# Altium project Medtrack_YLDB.PrjPCB
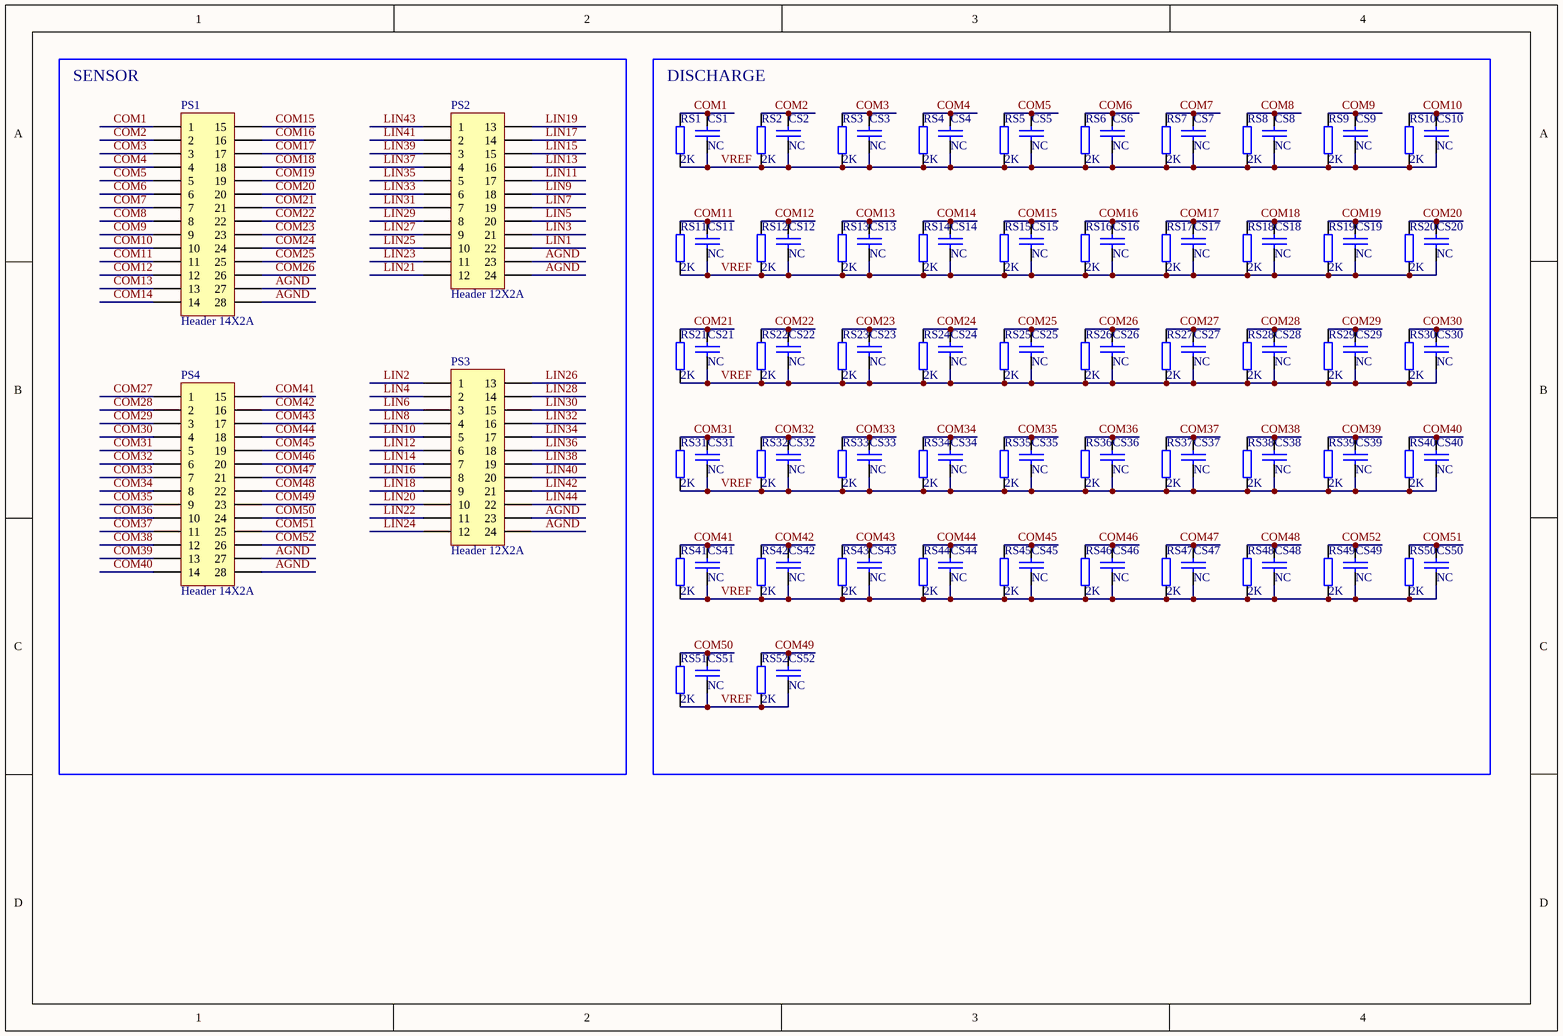
[diagram p0: Pressure_SENSOR.SchDoc]
6 sheets, 532 parts. Net scope: global (net labels, ports and power ports of the same name join across sheets).
Board file: Medtrack_YLDB_V2.0.PcbDoc
Sheets:
  Pressure_SENSOR.SchDoc
  Pressure_PM.SchDoc
  Pressure_INPUT.SchDoc
  Pressure_OUTPUT.SchDoc
  Pressure_MCU407.SchDoc
  Pressure_ADIN.SchDoc

## Sheet Pressure_SENSOR.SchDoc
size A4

### Parts
CS1  NC  [c0603_HSC100]
CS2  NC  [c0603_HSC100]
CS3  NC  [c0603_HSC100]
CS4  NC  [c0603_HSC100]
CS5  NC  [c0603_HSC100]
CS6  NC  [c0603_HSC100]
CS7  NC  [c0603_HSC100]
CS8  NC  [c0603_HSC100]
CS9  NC  [c0603_HSC100]
CS10  NC  [c0603_HSC100]
CS11  NC  [c0603_HSC100]
CS12  NC  [c0603_HSC100]
CS13  NC  [c0603_HSC100]
CS14  NC  [c0603_HSC100]
CS15  NC  [c0603_HSC100]
CS16  NC  [c0603_HSC100]
CS17  NC  [c0603_HSC100]
CS18  NC  [c0603_HSC100]
CS19  NC  [c0603_HSC100]
CS20  NC  [c0603_HSC100]
CS21  NC  [c0603_HSC100]
CS22  NC  [c0603_HSC100]
CS23  NC  [c0603_HSC100]
CS24  NC  [c0603_HSC100]
CS25  NC  [c0603_HSC100]
CS26  NC  [c0603_HSC100]
CS27  NC  [c0603_HSC100]
CS28  NC  [c0603_HSC100]
CS29  NC  [c0603_HSC100]
CS30  NC  [c0603_HSC100]
CS31  NC  [c0603_HSC100]
CS32  NC  [c0603_HSC100]
CS33  NC  [c0603_HSC100]
CS34  NC  [c0603_HSC100]
CS35  NC  [c0603_HSC100]
CS36  NC  [c0603_HSC100]
CS37  NC  [c0603_HSC100]
CS38  NC  [c0603_HSC100]
CS39  NC  [c0603_HSC100]
CS40  NC  [c0603_HSC100]
CS41  NC  [c0603_HSC100]
CS42  NC  [c0603_HSC100]
CS43  NC  [c0603_HSC100]
CS44  NC  [c0603_HSC100]
CS45  NC  [c0603_HSC100]
CS46  NC  [c0603_HSC100]
CS47  NC  [c0603_HSC100]
CS48  NC  [c0603_HSC100]
CS49  NC  [c0603_HSC100]
CS50  NC  [c0603_HSC100]
CS51  NC  [c0603_HSC100]
CS52  NC  [c0603_HSC100]
PS1  Header 14X2A  [FPC-1.0-26]
PS2  Header 12X2A  [FPC-1.0-22]
PS3  Header 12X2A  [FPC-1.0-22]
PS4  Header 14X2A  [FPC-1.0-26]
RS1  2K  [R0603_HSC100]
RS2  2K  [R0603_HSC100]
RS3  2K  [R0603_HSC100]
RS4  2K  [R0603_HSC100]
RS5  2K  [R0603_HSC100]
RS6  2K  [R0603_HSC100]
RS7  2K  [R0603_HSC100]
RS8  2K  [R0603_HSC100]
RS9  2K  [R0603_HSC100]
RS10  2K  [R0603_HSC100]
RS11  2K  [R0603_HSC100]
RS12  2K  [R0603_HSC100]
RS13  2K  [R0603_HSC100]
RS14  2K  [R0603_HSC100]
RS15  2K  [R0603_HSC100]
RS16  2K  [R0603_HSC100]
RS17  2K  [R0603_HSC100]
RS18  2K  [R0603_HSC100]
RS19  2K  [R0603_HSC100]
RS20  2K  [R0603_HSC100]
RS21  2K  [R0603_HSC100]
RS22  2K  [R0603_HSC100]
RS23  2K  [R0603_HSC100]
RS24  2K  [R0603_HSC100]
RS25  2K  [R0603_HSC100]
RS26  2K  [R0603_HSC100]
RS27  2K  [R0603_HSC100]
RS28  2K  [R0603_HSC100]
RS29  2K  [R0603_HSC100]
RS30  2K  [R0603_HSC100]
RS31  2K  [R0603_HSC100]
RS32  2K  [R0603_HSC100]
RS33  2K  [R0603_HSC100]
RS34  2K  [R0603_HSC100]
RS35  2K  [R0603_HSC100]
RS36  2K  [R0603_HSC100]
RS37  2K  [R0603_HSC100]
RS38  2K  [R0603_HSC100]
RS39  2K  [R0603_HSC100]
RS40  2K  [R0603_HSC100]
RS41  2K  [R0603_HSC100]
RS42  2K  [R0603_HSC100]
RS43  2K  [R0603_HSC100]
RS44  2K  [R0603_HSC100]
RS45  2K  [R0603_HSC100]
RS46  2K  [R0603_HSC100]
RS47  2K  [R0603_HSC100]
RS48  2K  [R0603_HSC100]
RS49  2K  [R0603_HSC100]
RS50  2K  [R0603_HSC100]
RS51  2K  [R0603_HSC100]
RS52  2K  [R0603_HSC100]

### Blocks framed on the sheet
SENSOR: PS1-PS4
DISCHARGE: CS1-CS52 RS1-RS52

### Nets
AGND: PS1.27 PS1.28 PS2.23 PS2.24 PS3.23 PS3.24 PS4.27 PS4.28
COM1: CS1.2 PS1.1 RS1.2
COM2: CS2.2 PS1.2 RS2.2
COM3: CS3.2 PS1.3 RS3.2
COM4: CS4.2 PS1.4 RS4.2
COM5: CS5.2 PS1.5 RS5.2
COM6: CS6.2 PS1.6 RS6.2
COM7: CS7.2 PS1.7 RS7.2
COM8: CS8.2 PS1.8 RS8.2
COM9: CS9.2 PS1.9 RS9.2
COM10: CS10.2 PS1.10 RS10.2
COM11: CS11.2 PS1.11 RS11.2
COM12: CS12.2 PS1.12 RS12.2
COM13: CS13.2 PS1.13 RS13.2
COM14: CS14.2 PS1.14 RS14.2
COM15: CS15.2 PS1.15 RS15.2
COM16: CS16.2 PS1.16 RS16.2
COM17: CS17.2 PS1.17 RS17.2
COM18: CS18.2 PS1.18 RS18.2
COM19: CS19.2 PS1.19 RS19.2
COM20: CS20.2 PS1.20 RS20.2
COM21: CS21.2 PS1.21 RS21.2
COM22: CS22.2 PS1.22 RS22.2
COM23: CS23.2 PS1.23 RS23.2
COM24: CS24.2 PS1.24 RS24.2
COM25: CS25.2 PS1.25 RS25.2
COM26: CS26.2 PS1.26 RS26.2
COM27: CS27.2 PS4.1 RS27.2
COM28: CS28.2 PS4.2 RS28.2
COM29: CS29.2 PS4.3 RS29.2
COM30: CS30.2 PS4.4 RS30.2
COM31: CS31.2 PS4.5 RS31.2
COM32: CS32.2 PS4.6 RS32.2
COM33: CS33.2 PS4.7 RS33.2
COM34: CS34.2 PS4.8 RS34.2
COM35: CS35.2 PS4.9 RS35.2
COM36: CS36.2 PS4.10 RS36.2
COM37: CS37.2 PS4.11 RS37.2
COM38: CS38.2 PS4.12 RS38.2
COM39: CS39.2 PS4.13 RS39.2
COM40: CS40.2 PS4.14 RS40.2
COM41: CS41.2 PS4.15 RS41.2
COM42: CS42.2 PS4.16 RS42.2
COM43: CS43.2 PS4.17 RS43.2
COM44: CS44.2 PS4.18 RS44.2
COM45: CS45.2 PS4.19 RS45.2
COM46: CS46.2 PS4.20 RS46.2
COM47: CS47.2 PS4.21 RS47.2
COM48: CS48.2 PS4.22 RS48.2
COM49: CS52.2 PS4.23 RS52.2
COM50: CS51.2 PS4.24 RS51.2
COM51: CS50.2 PS4.25 RS50.2
COM52: CS49.2 PS4.26 RS49.2
LIN1: PS2.22
LIN2: PS3.1
LIN3: PS2.21
LIN4: PS3.2
LIN5: PS2.20
LIN6: PS3.3
LIN7: PS2.19
LIN8: PS3.4
LIN9: PS2.18
LIN10: PS3.5
LIN11: PS2.17
LIN12: PS3.6
LIN13: PS2.16
LIN14: PS3.7
LIN15: PS2.15
LIN16: PS3.8
LIN17: PS2.14
LIN18: PS3.9
LIN19: PS2.13
LIN20: PS3.10
LIN21: PS2.12
LIN22: PS3.11
LIN23: PS2.11
LIN24: PS3.12
LIN25: PS2.10
LIN26: PS3.13
LIN27: PS2.9
LIN28: PS3.14
LIN29: PS2.8
LIN30: PS3.15
LIN31: PS2.7
LIN32: PS3.16
LIN33: PS2.6
LIN34: PS3.17
LIN35: PS2.5
LIN36: PS3.18
LIN37: PS2.4
LIN38: PS3.19
LIN39: PS2.3
LIN40: PS3.20
LIN41: PS2.2
LIN42: PS3.21
LIN43: PS2.1
LIN44: PS3.22
VREF: CS1.1 CS2.1 CS3.1 CS4.1 CS5.1 CS6.1 CS7.1 CS8.1 CS9.1 CS10.1 CS11.1 CS12.1 CS13.1 CS14.1 CS15.1 CS16.1 CS17.1 CS18.1 CS19.1 CS20.1 CS21.1 CS22.1 CS23.1 CS24.1 CS25.1 CS26.1 CS27.1 CS28.1 CS29.1 CS30.1 CS31.1 CS32.1 CS33.1 CS34.1 CS35.1 CS36.1 CS37.1 CS38.1 CS39.1 CS40.1 CS41.1 CS42.1 CS43.1 CS44.1 CS45.1 CS46.1 CS47.1 CS48.1 CS49.1 CS50.1 CS51.1 CS52.1 RS1.1 RS2.1 RS3.1 RS4.1 RS5.1 RS6.1 RS7.1 RS8.1 RS9.1 RS10.1 RS11.1 RS12.1 RS13.1 RS14.1 RS15.1 RS16.1 RS17.1 RS18.1 RS19.1 RS20.1 RS21.1 RS22.1 RS23.1 RS24.1 RS25.1 RS26.1 RS27.1 RS28.1 RS29.1 RS30.1 RS31.1 RS32.1 RS33.1 RS34.1 RS35.1 RS36.1 RS37.1 RS38.1 RS39.1 RS40.1 RS41.1 RS42.1 RS43.1 RS44.1 RS45.1 RS46.1 RS47.1 RS48.1 RS49.1 RS50.1 RS51.1 RS52.1

### Library data of the parts
CS1-CS52 = CAP: Capacitor
PS1 PS4 = Header 14X2A: Header, 14-Pin, Dual row; LatestRevisionDate: 17-Jul-2002; LatestRevisionNote: Re-released for DXP Platform.; Publisher: Altium Limited
PS2 PS3 = Header 12X2A: Header, 12-Pin, Dual row; LatestRevisionDate: 17-Jul-2002; LatestRevisionNote: Re-released for DXP Platform.; Publisher: Altium Limited
RS1-RS52 = RES

## Sheet Pressure_PM.SchDoc
size A4
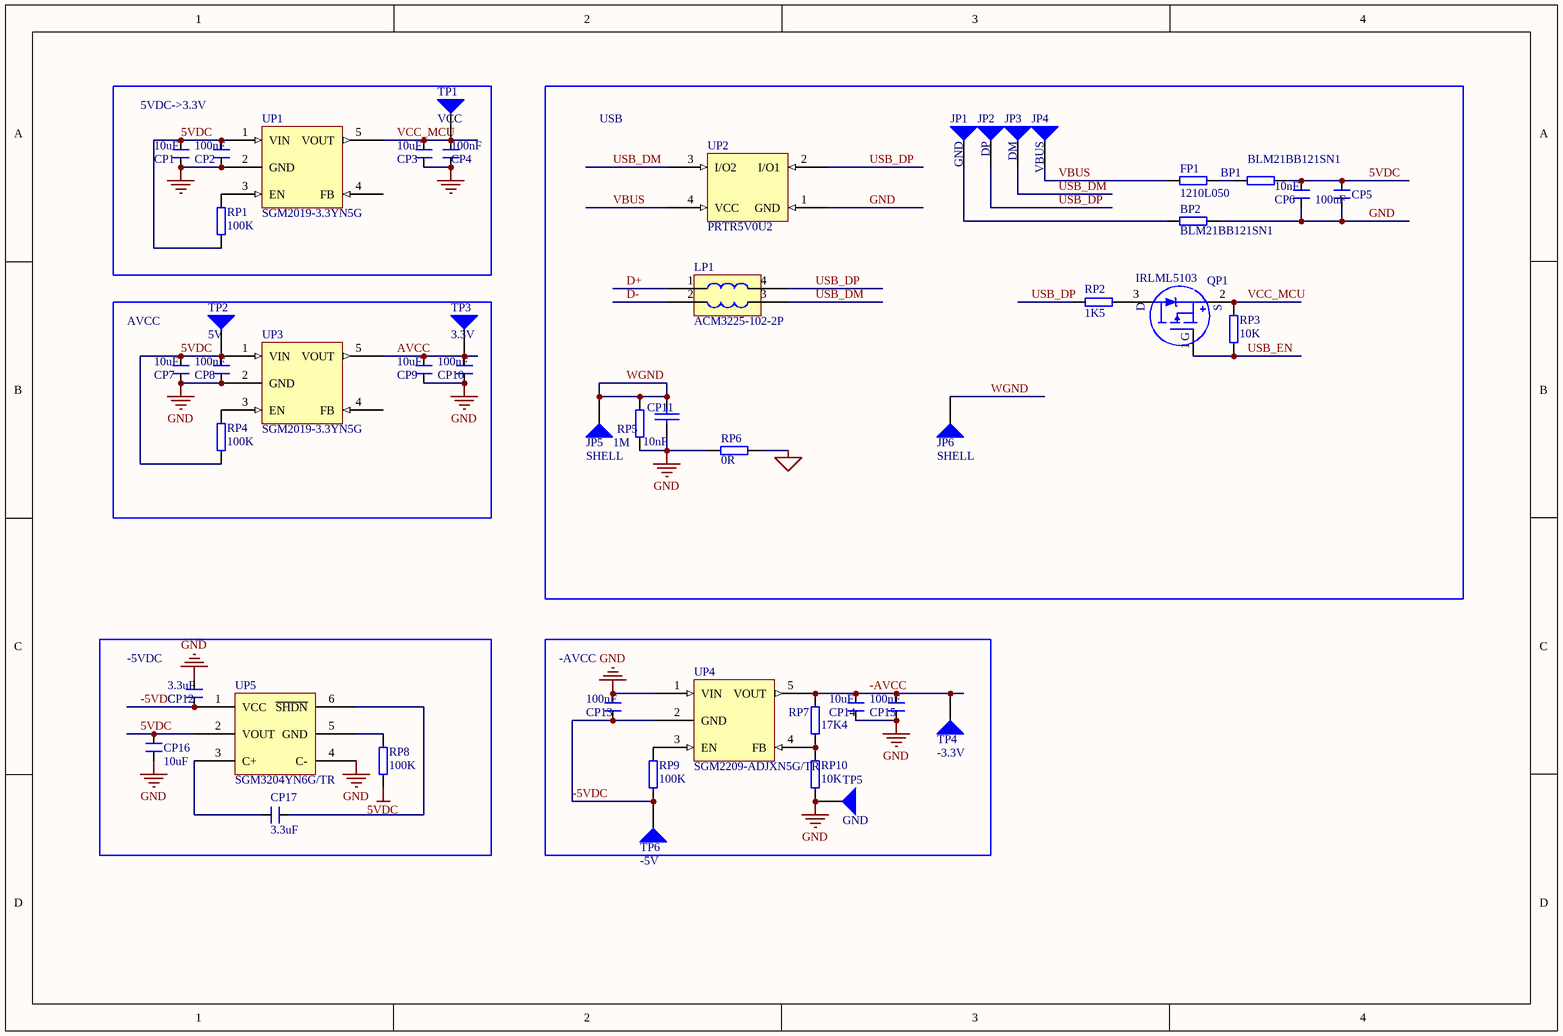
[diagram p1: Pressure_PM.SchDoc]

### Parts
BP1  BLM21BB121SN1  [C0805]
BP2  BLM21BB121SN1  [C0805]
CP1  10uF  [C0805]
CP2  100nF  [C0603_HSC100]
CP3  10uF  [C0805]
CP4  100nF  [C0603_HSC100]
CP5  100uF  [c6032]
CP6  10nF  [C0603_HSC100]
CP7  10uF  [C0805]
CP8  100nF  [C0603_HSC100]
CP9  10uF  [C0805]
CP10  100nF  [C0603_HSC100]
CP11  10nF  [C0603_HSC100]
CP12  3.3uF  [C0805]
CP13  100nF  [C0603_HSC100]
CP14  10uF  [C0805]
CP15  100nF  [C0603_HSC100]
CP16  10uF  [C0805]
CP17  3.3uF  [C0805]
FP1  1210L050  [C1206]
JP1  GND  [TPAD-CY]
JP2  DP  [TPAD-CY]
JP3  DM  [TPAD-CY]
JP4  VBUS  [TPAD-CY]
JP5  SHELL  [TPAD-CY]
JP6  SHELL  [TPAD-HXS]
LP1  ACM3225-102-2P  [3225]
QP1  IRLML5103  [TSMT3]
RP1  100K  [R0603_HSC100]
RP2  1K5  [R0603_HSC100]
RP3  10K  [R0603_HSC100]
RP4  100K  [R0603_HSC100]
RP5  1M  [R0603_HSC100]
RP6  0R  [R0603_HSC100]
RP7  17K4  [R0603_HSC100]
RP8  100K  [R0603_HSC100]
RP9  100K  [R0603_HSC100]
RP10  10K  [R0603_HSC100]
TP1  VCC  [TPAD-2MM]
TP2  5V  [TPAD-2MM]
TP3  3.3V  [TPAD-2MM]
TP4  -3.3V  [TPAD-2MM]
TP5  GND  [TPAD-2MM]
TP6  -5V  [TPAD-2MM]
UP1  SGM2019-3.3YN5G  [SOT23-5]
UP2  PRTR5V0U2  [SOT143B]
UP3  SGM2019-3.3YN5G  [SOT23-5]
UP4  SGM2209-ADJXN5G/TR  [SOT23-5]
UP5  SGM3204YN6G/TR  [SOT23-6M]

### Blocks framed on the sheet
5VDC->3.3V: CP1-CP4 RP1 TP1 UP1
USB: BP1 BP2 CP5 CP6 CP11 FP1 JP1-JP6 LP1 QP1 RP2 RP3 RP5 RP6 UP2
AVCC: CP7-CP10 RP4 TP2 TP3 UP3
-5VDC: CP12 CP16 CP17 RP8 UP5
-AVCC: CP13-CP15 RP7 RP9 RP10 TP4-TP6 UP4

### Nets
5VDC: BP1.1 CP1.2 CP2.2 CP5.1 CP6.2 CP7.2 CP8.2 CP16.1 RP1.2 RP4.2 RP8.1 TP2.1 UP1.1(VIN) UP3.1(VIN) UP5.2(VOUT)
AGND: RP6.1
GND: BP2.1 CP1.1 CP2.1 CP3.1 CP4.1 CP5.2 CP6.1 CP7.1 CP8.1 CP9.1 CP10.1 CP11.2 CP12.2 CP13.2 CP14.1 CP15.1 CP16.2 RP5.1 RP6.2 RP10.2 TP5.1 UP1.2(GND) UP2.1(GND) UP3.2(GND) UP4.1(VIN) UP5.4(C-)
VCC_MCU: CP3.2 CP4.2 QP1.2 RP3.1 TP1.1 UP1.5(VOUT)
-5VDC: CP12.1 CP13.1 RP9.2 TP6.1 UP4.2(GND) UP5.1(VCC)
-AVCC: CP14.2 CP15.2 RP7.1 TP4.1 UP4.5(VOUT)
AVCC: CP9.2 CP10.2 TP3.1 UP3.5(VOUT)
D+: LP1.1
D-: LP1.2
USB_DM: JP3.1 LP1.3 UP2.3(I/O2)
USB_DP: JP2.1 LP1.4 RP2.2 UP2.2(I/O1)
USB_EN: QP1.1 RP3.2
VBUS: FP1.2 JP4.1 UP2.4(VCC)
WGND: CP11.1 JP5.1 JP6.1 RP5.2
NetBP1_2: BP1.2 FP1.1
NetBP2_2: BP2.2 JP1.1
NetCP17_1: CP17.1 UP5.6(~{SHDN})
NetCP17_2: CP17.2 UP5.3(C+)
NetQP1_3: QP1.3 RP2.1
NetRP1_1: RP1.1 UP1.3(EN)
NetRP4_1: RP4.1 UP3.3(EN)
NetRP7_2: RP7.2 RP10.1 UP4.4(FB)
NetRP8_2: RP8.2 UP5.5(GND)
NetRP9_1: RP9.1 UP4.3(EN)

Not connected (* = marked no-connect by the designer): UP1 4(FB); UP3 4(FB)

### Notes on the sheet
- (in symbol RTR030P02) D; S; G

### Library data of the parts
BP1 BP2 FP1 RP1-RP10 = RES
CP1-CP10 CP12-CP17 = CAP_M
CP11 = CAP: Capacitor
JP1-JP6 TP1-TP6 = TPAD: Connector
LP1 = ACM3225-102-2P: ACM3225
QP1 = RTR030P02
UP1 UP3 UP4 = XC6201: XC6201M331
UP5 = LTC1983

## Sheet Pressure_INPUT.SchDoc
size A3
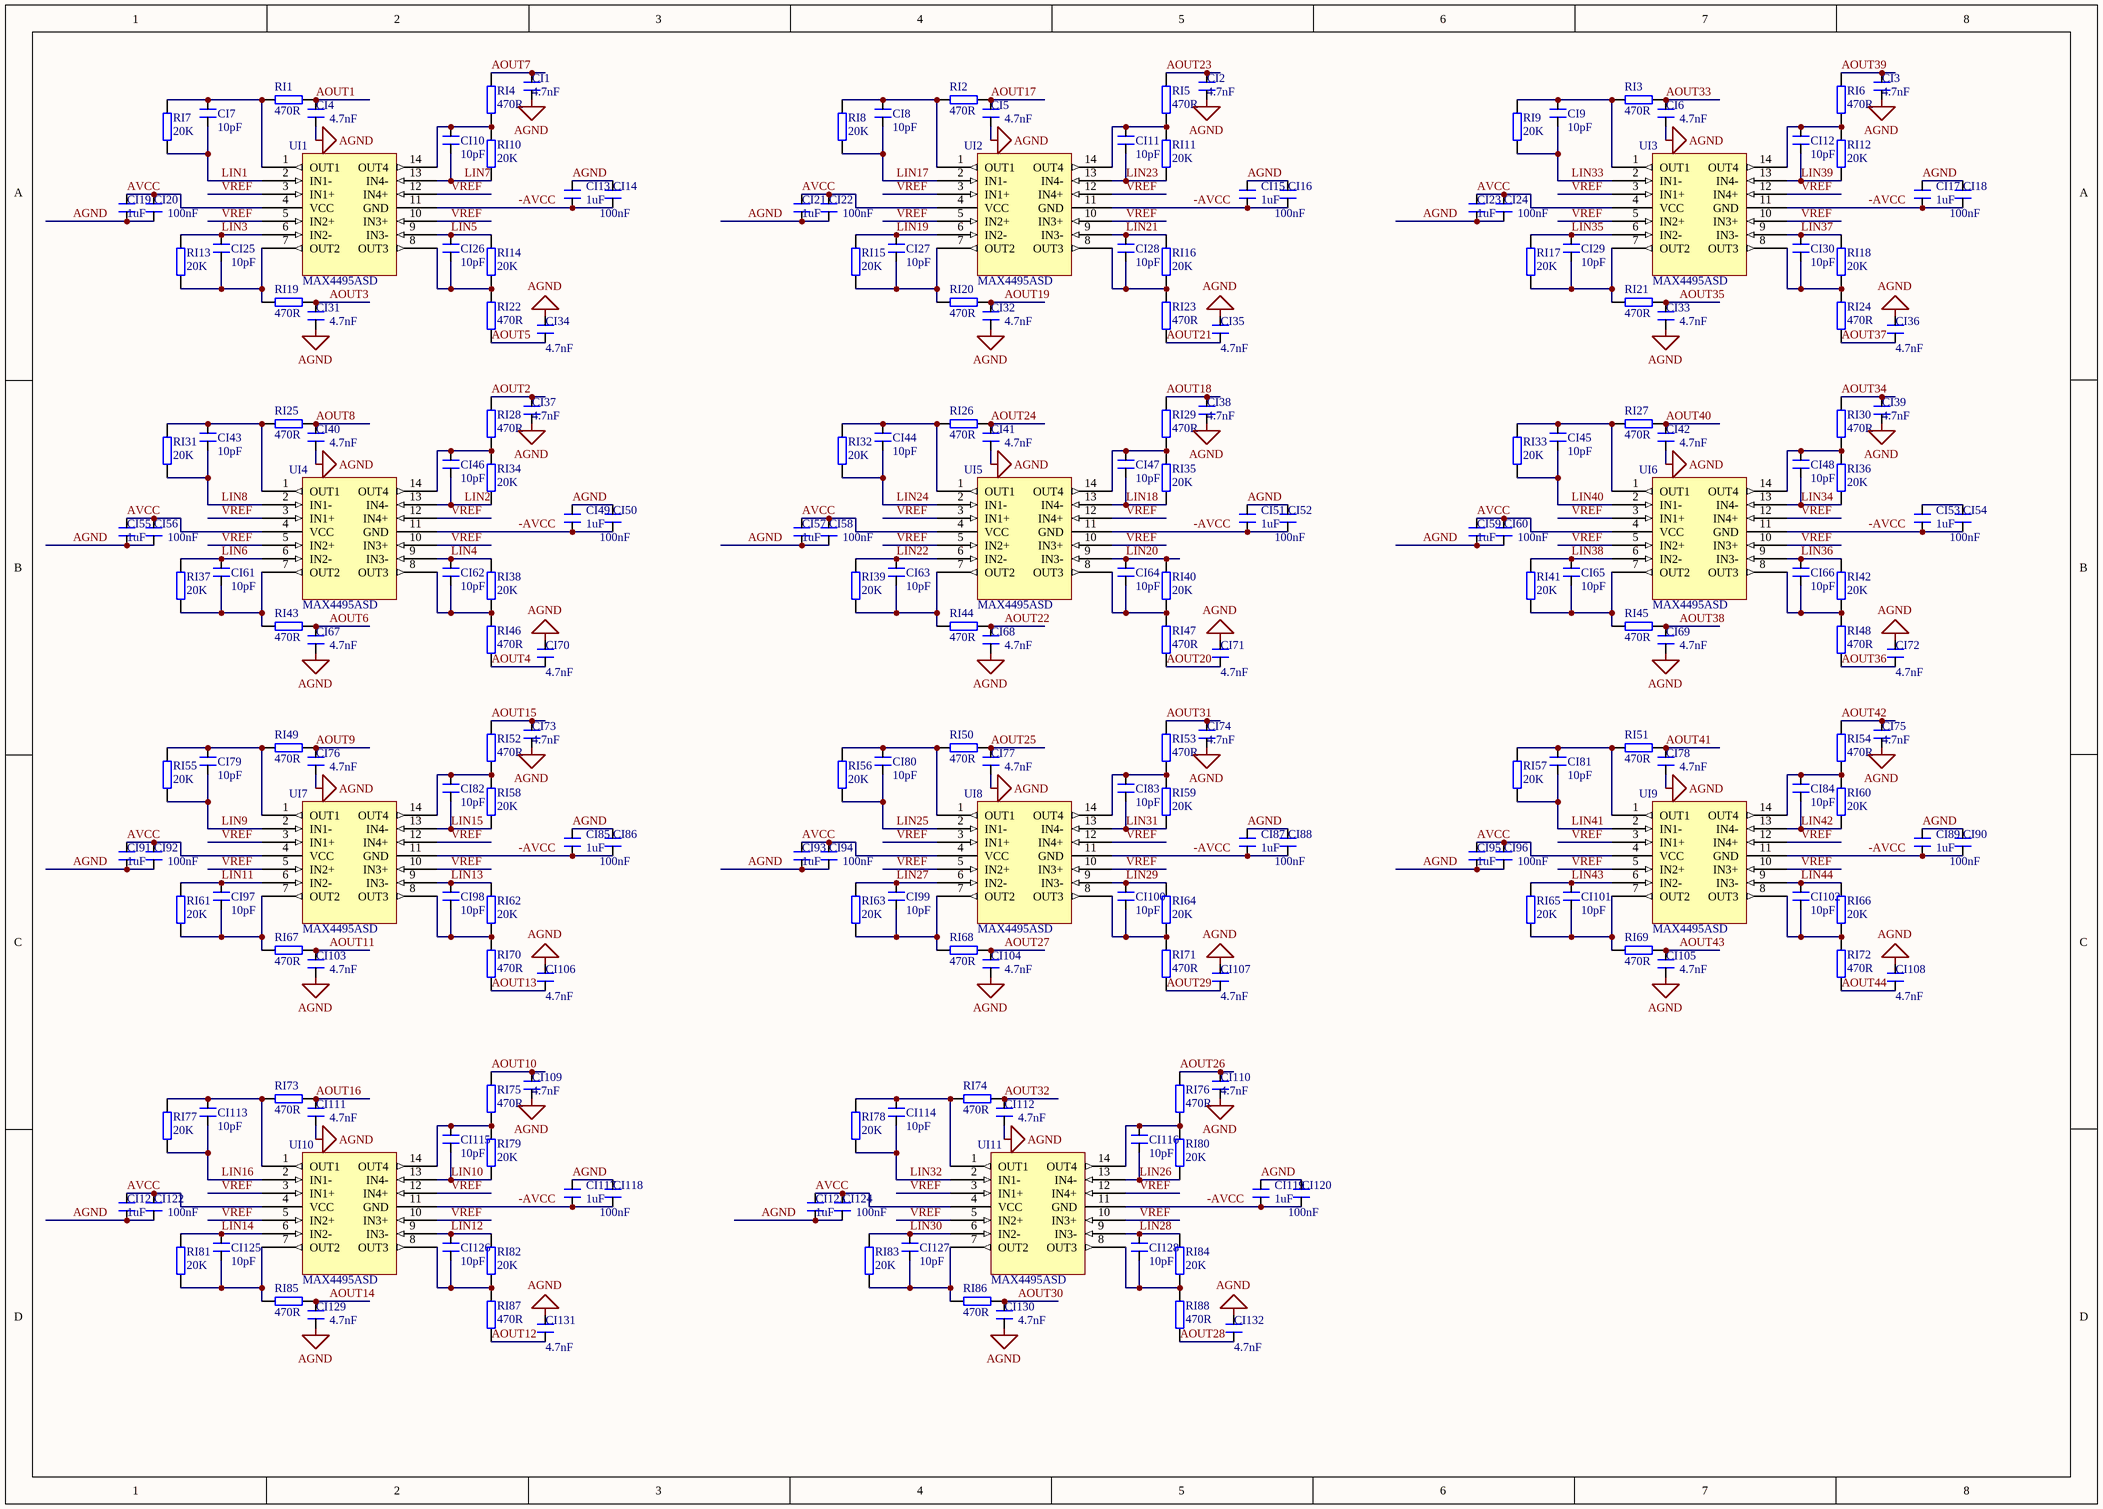
[diagram p2: Pressure_INPUT.SchDoc]

### Parts
CI1  4.7nF  [C0603_HSC100]
CI2  4.7nF  [C0603_HSC100]
CI3  4.7nF  [C0603_HSC100]
CI4  4.7nF  [C0603_HSC100]
CI5  4.7nF  [C0603_HSC100]
CI6  4.7nF  [C0603_HSC100]
CI7  10pF  [C0603_HSC100]
CI8  10pF  [C0603_HSC100]
CI9  10pF  [C0603_HSC100]
CI10  10pF  [C0603_HSC100]
CI11  10pF  [C0603_HSC100]
CI12  10pF  [C0603_HSC100]
CI13  1uF  [C0603_HSC100]
CI14  100nF  [C0603_HSC100]
CI15  1uF  [C0603_HSC100]
CI16  100nF  [C0603_HSC100]
CI17  1uF  [C0603_HSC100]
CI18  100nF  [C0603_HSC100]
CI19  1uF  [C0603_HSC100]
CI20  100nF  [C0603_HSC100]
CI21  1uF  [C0603_HSC100]
CI22  100nF  [C0603_HSC100]
CI23  1uF  [C0603_HSC100]
CI24  100nF  [C0603_HSC100]
CI25  10pF  [C0603_HSC100]
CI26  10pF  [C0603_HSC100]
CI27  10pF  [C0603_HSC100]
CI28  10pF  [C0603_HSC100]
CI29  10pF  [C0603_HSC100]
CI30  10pF  [C0603_HSC100]
CI31  4.7nF  [C0603_HSC100]
CI32  4.7nF  [C0603_HSC100]
CI33  4.7nF  [C0603_HSC100]
CI34  4.7nF  [C0603_HSC100]
CI35  4.7nF  [C0603_HSC100]
CI36  4.7nF  [C0603_HSC100]
CI37  4.7nF  [C0603_HSC100]
CI38  4.7nF  [C0603_HSC100]
CI39  4.7nF  [C0603_HSC100]
CI40  4.7nF  [C0603_HSC100]
CI41  4.7nF  [C0603_HSC100]
CI42  4.7nF  [C0603_HSC100]
CI43  10pF  [C0603_HSC100]
CI44  10pF  [C0603_HSC100]
CI45  10pF  [C0603_HSC100]
CI46  10pF  [C0603_HSC100]
CI47  10pF  [C0603_HSC100]
CI48  10pF  [C0603_HSC100]
CI49  1uF  [C0603_HSC100]
CI50  100nF  [C0603_HSC100]
CI51  1uF  [C0603_HSC100]
CI52  100nF  [C0603_HSC100]
CI53  1uF  [C0603_HSC100]
CI54  100nF  [C0603_HSC100]
CI55  1uF  [C0603_HSC100]
CI56  100nF  [C0603_HSC100]
CI57  1uF  [C0603_HSC100]
CI58  100nF  [C0603_HSC100]
CI59  1uF  [C0603_HSC100]
CI60  100nF  [C0603_HSC100]
CI61  10pF  [C0603_HSC100]
CI62  10pF  [C0603_HSC100]
CI63  10pF  [C0603_HSC100]
CI64  10pF  [C0603_HSC100]
CI65  10pF  [C0603_HSC100]
CI66  10pF  [C0603_HSC100]
CI67  4.7nF  [C0603_HSC100]
CI68  4.7nF  [C0603_HSC100]
CI69  4.7nF  [C0603_HSC100]
CI70  4.7nF  [C0603_HSC100]
CI71  4.7nF  [C0603_HSC100]
CI72  4.7nF  [C0603_HSC100]
CI73  4.7nF  [C0603_HSC100]
CI74  4.7nF  [C0603_HSC100]
CI75  4.7nF  [C0603_HSC100]
CI76  4.7nF  [C0603_HSC100]
CI77  4.7nF  [C0603_HSC100]
CI78  4.7nF  [C0603_HSC100]
CI79  10pF  [C0603_HSC100]
CI80  10pF  [C0603_HSC100]
CI81  10pF  [C0603_HSC100]
CI82  10pF  [C0603_HSC100]
CI83  10pF  [C0603_HSC100]
CI84  10pF  [C0603_HSC100]
CI85  1uF  [C0603_HSC100]
CI86  100nF  [C0603_HSC100]
CI87  1uF  [C0603_HSC100]
CI88  100nF  [C0603_HSC100]
CI89  1uF  [C0603_HSC100]
CI90  100nF  [C0603_HSC100]
CI91  1uF  [C0603_HSC100]
CI92  100nF  [C0603_HSC100]
CI93  1uF  [C0603_HSC100]
CI94  100nF  [C0603_HSC100]
CI95  1uF  [C0603_HSC100]
CI96  100nF  [C0603_HSC100]
CI97  10pF  [C0603_HSC100]
CI98  10pF  [C0603_HSC100]
CI99  10pF  [C0603_HSC100]
CI100  10pF  [C0603_HSC100]
CI101  10pF  [C0603_HSC100]
CI102  10pF  [C0603_HSC100]
CI103  4.7nF  [C0603_HSC100]
CI104  4.7nF  [C0603_HSC100]
CI105  4.7nF  [C0603_HSC100]
CI106  4.7nF  [C0603_HSC100]
CI107  4.7nF  [C0603_HSC100]
CI108  4.7nF  [C0603_HSC100]
CI109  4.7nF  [C0603_HSC100]
CI110  4.7nF  [C0603_HSC100]
CI111  4.7nF  [C0603_HSC100]
CI112  4.7nF  [C0603_HSC100]
CI113  10pF  [C0603_HSC100]
CI114  10pF  [C0603_HSC100]
CI115  10pF  [C0603_HSC100]
CI116  10pF  [C0603_HSC100]
CI117  1uF  [C0603_HSC100]
CI118  100nF  [C0603_HSC100]
CI119  1uF  [C0603_HSC100]
CI120  100nF  [C0603_HSC100]
CI121  1uF  [C0603_HSC100]
CI122  100nF  [C0603_HSC100]
CI123  1uF  [C0603_HSC100]
CI124  100nF  [C0603_HSC100]
CI125  10pF  [C0603_HSC100]
CI126  10pF  [C0603_HSC100]
CI127  10pF  [C0603_HSC100]
CI128  10pF  [C0603_HSC100]
CI129  4.7nF  [C0603_HSC100]
CI130  4.7nF  [C0603_HSC100]
CI131  4.7nF  [C0603_HSC100]
CI132  4.7nF  [C0603_HSC100]
RI1  470R  [R0603_HSC100]
RI2  470R  [R0603_HSC100]
RI3  470R  [R0603_HSC100]
RI4  470R  [R0603_HSC100]
RI5  470R  [R0603_HSC100]
RI6  470R  [R0603_HSC100]
RI7  20K  [R0603_HSC100]
RI8  20K  [R0603_HSC100]
RI9  20K  [R0603_HSC100]
RI10  20K  [R0603_HSC100]
RI11  20K  [R0603_HSC100]
RI12  20K  [R0603_HSC100]
RI13  20K  [R0603_HSC100]
RI14  20K  [R0603_HSC100]
RI15  20K  [R0603_HSC100]
RI16  20K  [R0603_HSC100]
RI17  20K  [R0603_HSC100]
RI18  20K  [R0603_HSC100]
RI19  470R  [R0603_HSC100]
RI20  470R  [R0603_HSC100]
RI21  470R  [R0603_HSC100]
RI22  470R  [R0603_HSC100]
RI23  470R  [R0603_HSC100]
RI24  470R  [R0603_HSC100]
RI25  470R  [R0603_HSC100]
RI26  470R  [R0603_HSC100]
RI27  470R  [R0603_HSC100]
RI28  470R  [R0603_HSC100]
RI29  470R  [R0603_HSC100]
RI30  470R  [R0603_HSC100]
RI31  20K  [R0603_HSC100]
RI32  20K  [R0603_HSC100]
RI33  20K  [R0603_HSC100]
RI34  20K  [R0603_HSC100]
RI35  20K  [R0603_HSC100]
RI36  20K  [R0603_HSC100]
RI37  20K  [R0603_HSC100]
RI38  20K  [R0603_HSC100]
RI39  20K  [R0603_HSC100]
RI40  20K  [R0603_HSC100]
RI41  20K  [R0603_HSC100]
RI42  20K  [R0603_HSC100]
RI43  470R  [R0603_HSC100]
RI44  470R  [R0603_HSC100]
RI45  470R  [R0603_HSC100]
RI46  470R  [R0603_HSC100]
RI47  470R  [R0603_HSC100]
RI48  470R  [R0603_HSC100]
RI49  470R  [R0603_HSC100]
RI50  470R  [R0603_HSC100]
RI51  470R  [R0603_HSC100]
RI52  470R  [R0603_HSC100]
RI53  470R  [R0603_HSC100]
RI54  470R  [R0603_HSC100]
RI55  20K  [R0603_HSC100]
RI56  20K  [R0603_HSC100]
RI57  20K  [R0603_HSC100]
RI58  20K  [R0603_HSC100]
RI59  20K  [R0603_HSC100]
RI60  20K  [R0603_HSC100]
RI61  20K  [R0603_HSC100]
RI62  20K  [R0603_HSC100]
RI63  20K  [R0603_HSC100]
RI64  20K  [R0603_HSC100]
RI65  20K  [R0603_HSC100]
RI66  20K  [R0603_HSC100]
RI67  470R  [R0603_HSC100]
RI68  470R  [R0603_HSC100]
RI69  470R  [R0603_HSC100]
RI70  470R  [R0603_HSC100]
RI71  470R  [R0603_HSC100]
RI72  470R  [R0603_HSC100]
RI73  470R  [R0603_HSC100]
RI74  470R  [R0603_HSC100]
RI75  470R  [R0603_HSC100]
RI76  470R  [R0603_HSC100]
RI77  20K  [R0603_HSC100]
RI78  20K  [R0603_HSC100]
RI79  20K  [R0603_HSC100]
RI80  20K  [R0603_HSC100]
RI81  20K  [R0603_HSC100]
RI82  20K  [R0603_HSC100]
RI83  20K  [R0603_HSC100]
RI84  20K  [R0603_HSC100]
RI85  470R  [R0603_HSC100]
RI86  470R  [R0603_HSC100]
RI87  470R  [R0603_HSC100]
RI88  470R  [R0603_HSC100]
UI1  MAX4495ASD  [SO-14]
UI2  MAX4495ASD  [SO-14]
UI3  MAX4495ASD  [SO-14]
UI4  MAX4495ASD  [SO-14]
UI5  MAX4495ASD  [SO-14]
UI6  MAX4495ASD  [SO-14]
UI7  MAX4495ASD  [SO-14]
UI8  MAX4495ASD  [SO-14]
UI9  MAX4495ASD  [SO-14]
UI10  MAX4495ASD  [SO-14]
UI11  MAX4495ASD  [SO-14]

### Nets
AGND: CI1.2 CI2.2 CI3.2 CI4.2 CI5.2 CI6.2 CI13.1 CI14.1 CI15.1 CI16.1 CI17.1 CI18.1 CI19.2 CI20.2 CI21.2 CI22.2 CI23.2 CI24.2 CI31.2 CI32.2 CI33.2 CI34.1 CI35.1 CI36.1 CI37.2 CI38.2 CI39.2 CI40.2 CI41.2 CI42.2 CI49.1 CI50.1 CI51.1 CI52.1 CI55.2 CI56.2 CI57.2 CI58.2 CI59.2 CI60.2 CI67.2 CI68.2 CI69.2 CI70.1 CI71.1 CI72.1 CI73.2 CI74.2 CI75.2 CI76.2 CI77.2 CI78.2 CI85.1 CI86.1 CI87.1 CI88.1 CI89.1 CI90.1 CI91.2 CI92.2 CI93.2 CI94.2 CI95.2 CI96.2 CI103.2 CI104.2 CI105.2 CI106.1 CI107.1 CI108.1 CI109.2 CI110.2 CI111.2 CI112.2 CI117.1 CI118.1 CI119.1 CI120.1 CI121.2 CI122.2 CI123.2 CI124.2 CI129.2 CI130.2 CI131.1 CI132.1
-AVCC: CI13.2 CI14.2 CI15.2 CI16.2 CI17.2 CI18.2 CI49.2 CI50.2 CI51.2 CI52.2 CI53.2 CI54.2 CI85.2 CI86.2 CI87.2 CI88.2 CI89.2 CI90.2 CI117.2 CI118.2 CI119.2 CI120.2 UI1.11(GND) UI2.11(GND) UI3.11(GND) UI4.11(GND) UI5.11(GND) UI6.11(GND) UI7.11(GND) UI8.11(GND) UI9.11(GND) UI10.11(GND) UI11.11(GND)
AOUT1: CI4.1 RI1.1
AOUT2: CI37.1 RI28.2
AOUT3: CI31.1 RI19.1
AOUT4: CI70.2 RI46.2
AOUT5: CI34.2 RI22.2
AOUT6: CI67.1 RI43.1
AOUT7: CI1.1 RI4.2
AOUT8: CI40.1 RI25.1
AOUT9: CI76.1 RI49.1
AOUT10: CI109.1 RI75.2
AOUT11: CI103.1 RI67.1
AOUT12: CI131.2 RI87.2
AOUT13: CI106.2 RI70.2
AOUT14: CI129.1 RI85.1
AOUT15: CI73.1 RI52.2
AOUT16: CI111.1 RI73.1
AOUT17: CI5.1 RI2.1
AOUT18: CI38.1 RI29.2
AOUT19: CI32.1 RI20.1
AOUT20: CI71.2 RI47.2
AOUT21: CI35.2 RI23.2
AOUT22: CI68.1 RI44.1
AOUT23: CI2.1 RI5.2
AOUT24: CI41.1 RI26.1
AOUT25: CI77.1 RI50.1
AOUT26: CI110.1 RI76.2
AOUT27: CI104.1 RI68.1
AOUT28: CI132.2 RI88.2
AOUT29: CI107.2 RI71.2
AOUT30: CI130.1 RI86.1
AOUT31: CI74.1 RI53.2
AOUT32: CI112.1 RI74.1
AOUT33: CI6.1 RI3.1
AOUT34: CI39.1 RI30.2
AOUT35: CI33.1 RI21.1
AOUT36: CI72.2 RI48.2
AOUT37: CI36.2 RI24.2
AOUT38: CI69.1 RI45.1
AOUT39: CI3.1 RI6.2
AOUT40: CI42.1 RI27.1
AOUT41: CI78.1 RI51.1
AOUT42: CI75.1 RI54.2
AOUT43: CI105.1 RI69.1
AOUT44: CI108.2 RI72.2
AVCC: CI19.1 CI20.1 CI21.1 CI22.1 CI23.1 CI24.1 CI55.1 CI56.1 CI57.1 CI58.1 CI59.1 CI60.1 CI91.1 CI92.1 CI93.1 CI94.1 CI95.1 CI96.1 CI121.1 CI122.1 CI123.1 CI124.1 UI1.4(VCC) UI2.4(VCC) UI3.4(VCC) UI4.4(VCC) UI5.4(VCC) UI6.4(VCC) UI7.4(VCC) UI8.4(VCC) UI9.4(VCC) UI10.4(VCC) UI11.4(VCC)
LIN1: CI7.2 RI7.1 UI1.2(IN1-)
LIN2: CI46.2 RI34.1 UI4.13(IN4-)
LIN3: CI25.1 RI13.1 UI1.6(IN2-)
LIN4: CI62.1 RI38.2 UI4.9(IN3-)
LIN5: CI26.1 RI14.2 UI1.9(IN3-)
LIN6: CI61.1 RI37.1 UI4.6(IN2-)
LIN7: CI10.2 RI10.1 UI1.13(IN4-)
LIN8: CI43.2 RI31.1 UI4.2(IN1-)
LIN9: CI79.2 RI55.1 UI7.2(IN1-)
LIN10: CI115.2 RI79.1 UI10.13(IN4-)
LIN11: CI97.1 RI61.1 UI7.6(IN2-)
LIN12: CI126.1 RI82.2 UI10.9(IN3-)
LIN13: CI98.1 RI62.2 UI7.9(IN3-)
LIN14: CI125.1 RI81.1 UI10.6(IN2-)
LIN15: CI82.2 RI58.1 UI7.13(IN4-)
LIN16: CI113.2 RI77.1 UI10.2(IN1-)
LIN17: CI8.2 RI8.1 UI2.2(IN1-)
LIN18: CI47.2 RI35.1 UI5.13(IN4-)
LIN19: CI27.1 RI15.1 UI2.6(IN2-)
LIN20: CI64.1 RI40.2 UI5.9(IN3-)
LIN21: CI28.1 RI16.2 UI2.9(IN3-)
LIN22: CI63.1 RI39.1 UI5.6(IN2-)
LIN23: CI11.2 RI11.1 UI2.13(IN4-)
LIN24: CI44.2 RI32.1 UI5.2(IN1-)
LIN25: CI80.2 RI56.1 UI8.2(IN1-)
LIN26: CI116.2 RI80.1 UI11.13(IN4-)
LIN27: CI99.1 RI63.1 UI8.6(IN2-)
LIN28: CI128.1 RI84.2 UI11.9(IN3-)
LIN29: CI100.1 RI64.2 UI8.9(IN3-)
LIN30: CI127.1 RI83.1 UI11.6(IN2-)
LIN31: CI83.2 RI59.1 UI8.13(IN4-)
LIN32: CI114.2 RI78.1 UI11.2(IN1-)
LIN33: CI9.2 RI9.1 UI3.2(IN1-)
LIN34: CI48.2 RI36.1 UI6.13(IN4-)
LIN35: CI29.1 RI17.1 UI3.6(IN2-)
LIN36: CI66.1 RI42.2 UI6.9(IN3-)
LIN37: CI30.1 RI18.2 UI3.9(IN3-)
LIN38: CI65.1 RI41.1 UI6.6(IN2-)
LIN39: CI12.2 RI12.1 UI3.13(IN4-)
LIN40: CI45.2 RI33.1 UI6.2(IN1-)
LIN41: CI81.2 RI57.1 UI9.2(IN1-)
LIN42: CI84.2 RI60.1 UI9.13(IN4-)
LIN43: CI101.1 RI65.1 UI9.6(IN2-)
LIN44: CI102.1 RI66.2 UI9.9(IN3-)
VREF: UI1.3(IN1+) UI1.5(IN2+) UI1.10(IN3+) UI1.12(IN4+) UI2.3(IN1+) UI2.5(IN2+) UI2.10(IN3+) UI2.12(IN4+) UI3.3(IN1+) UI3.5(IN2+) UI3.10(IN3+) UI3.12(IN4+) UI4.3(IN1+) UI4.5(IN2+) UI4.10(IN3+) UI4.12(IN4+) UI5.3(IN1+) UI5.5(IN2+) UI5.10(IN3+) UI5.12(IN4+) UI6.3(IN1+) UI6.5(IN2+) UI6.10(IN3+) UI6.12(IN4+) UI7.3(IN1+) UI7.5(IN2+) UI7.10(IN3+) UI7.12(IN4+) UI8.3(IN1+) UI8.5(IN2+) UI8.10(IN3+) UI8.12(IN4+) UI9.3(IN1+) UI9.5(IN2+) UI9.10(IN3+) UI9.12(IN4+) UI10.3(IN1+) UI10.5(IN2+) UI10.10(IN3+) UI10.12(IN4+) UI11.3(IN1+) UI11.5(IN2+) UI11.10(IN3+) UI11.12(IN4+)
NetCI7_1: CI7.1 RI1.2 RI7.2 UI1.1(OUT1)
NetCI8_1: CI8.1 RI2.2 RI8.2 UI2.1(OUT1)
NetCI9_1: CI9.1 RI3.2 RI9.2 UI3.1(OUT1)
NetCI10_1: CI10.1 RI4.1 RI10.2 UI1.14(OUT4)
NetCI11_1: CI11.1 RI5.1 RI11.2 UI2.14(OUT4)
NetCI12_1: CI12.1 RI6.1 RI12.2 UI3.14(OUT4)
NetCI25_2: CI25.2 RI13.2 RI19.2 UI1.7(OUT2)
NetCI26_2: CI26.2 RI14.1 RI22.1 UI1.8(OUT3)
NetCI27_2: CI27.2 RI15.2 RI20.2 UI2.7(OUT2)
NetCI28_2: CI28.2 RI16.1 RI23.1 UI2.8(OUT3)
NetCI29_2: CI29.2 RI17.2 RI21.2 UI3.7(OUT2)
NetCI30_2: CI30.2 RI18.1 RI24.1 UI3.8(OUT3)
NetCI43_1: CI43.1 RI25.2 RI31.2 UI4.1(OUT1)
NetCI44_1: CI44.1 RI26.2 RI32.2 UI5.1(OUT1)
NetCI45_1: CI45.1 RI27.2 RI33.2 UI6.1(OUT1)
NetCI46_1: CI46.1 RI28.1 RI34.2 UI4.14(OUT4)
NetCI47_1: CI47.1 RI29.1 RI35.2 UI5.14(OUT4)
NetCI48_1: CI48.1 RI30.1 RI36.2 UI6.14(OUT4)
NetCI53_1: CI53.1 CI54.1
NetCI61_2: CI61.2 RI37.2 RI43.2 UI4.7(OUT2)
NetCI62_2: CI62.2 RI38.1 RI46.1 UI4.8(OUT3)
NetCI63_2: CI63.2 RI39.2 RI44.2 UI5.7(OUT2)
NetCI64_2: CI64.2 RI40.1 RI47.1 UI5.8(OUT3)
NetCI65_2: CI65.2 RI41.2 RI45.2 UI6.7(OUT2)
NetCI66_2: CI66.2 RI42.1 RI48.1 UI6.8(OUT3)
NetCI79_1: CI79.1 RI49.2 RI55.2 UI7.1(OUT1)
NetCI80_1: CI80.1 RI50.2 RI56.2 UI8.1(OUT1)
NetCI81_1: CI81.1 RI51.2 RI57.2 UI9.1(OUT1)
NetCI82_1: CI82.1 RI52.1 RI58.2 UI7.14(OUT4)
NetCI83_1: CI83.1 RI53.1 RI59.2 UI8.14(OUT4)
NetCI84_1: CI84.1 RI54.1 RI60.2 UI9.14(OUT4)
NetCI97_2: CI97.2 RI61.2 RI67.2 UI7.7(OUT2)
NetCI98_2: CI98.2 RI62.1 RI70.1 UI7.8(OUT3)
NetCI99_2: CI99.2 RI63.2 RI68.2 UI8.7(OUT2)
NetCI100_2: CI100.2 RI64.1 RI71.1 UI8.8(OUT3)
NetCI101_2: CI101.2 RI65.2 RI69.2 UI9.7(OUT2)
NetCI102_2: CI102.2 RI66.1 RI72.1 UI9.8(OUT3)
NetCI113_1: CI113.1 RI73.2 RI77.2 UI10.1(OUT1)
NetCI114_1: CI114.1 RI74.2 RI78.2 UI11.1(OUT1)
NetCI115_1: CI115.1 RI75.1 RI79.2 UI10.14(OUT4)
NetCI116_1: CI116.1 RI76.1 RI80.2 UI11.14(OUT4)
NetCI125_2: CI125.2 RI81.2 RI85.2 UI10.7(OUT2)
NetCI126_2: CI126.2 RI82.1 RI87.1 UI10.8(OUT3)
NetCI127_2: CI127.2 RI83.2 RI86.2 UI11.7(OUT2)
NetCI128_2: CI128.2 RI84.1 RI88.1 UI11.8(OUT3)

### Library data of the parts
CI1-CI132 = CAP_M
RI1-RI88 = RES
UI1-UI11 = LM324

## Sheet Pressure_OUTPUT.SchDoc
size A4
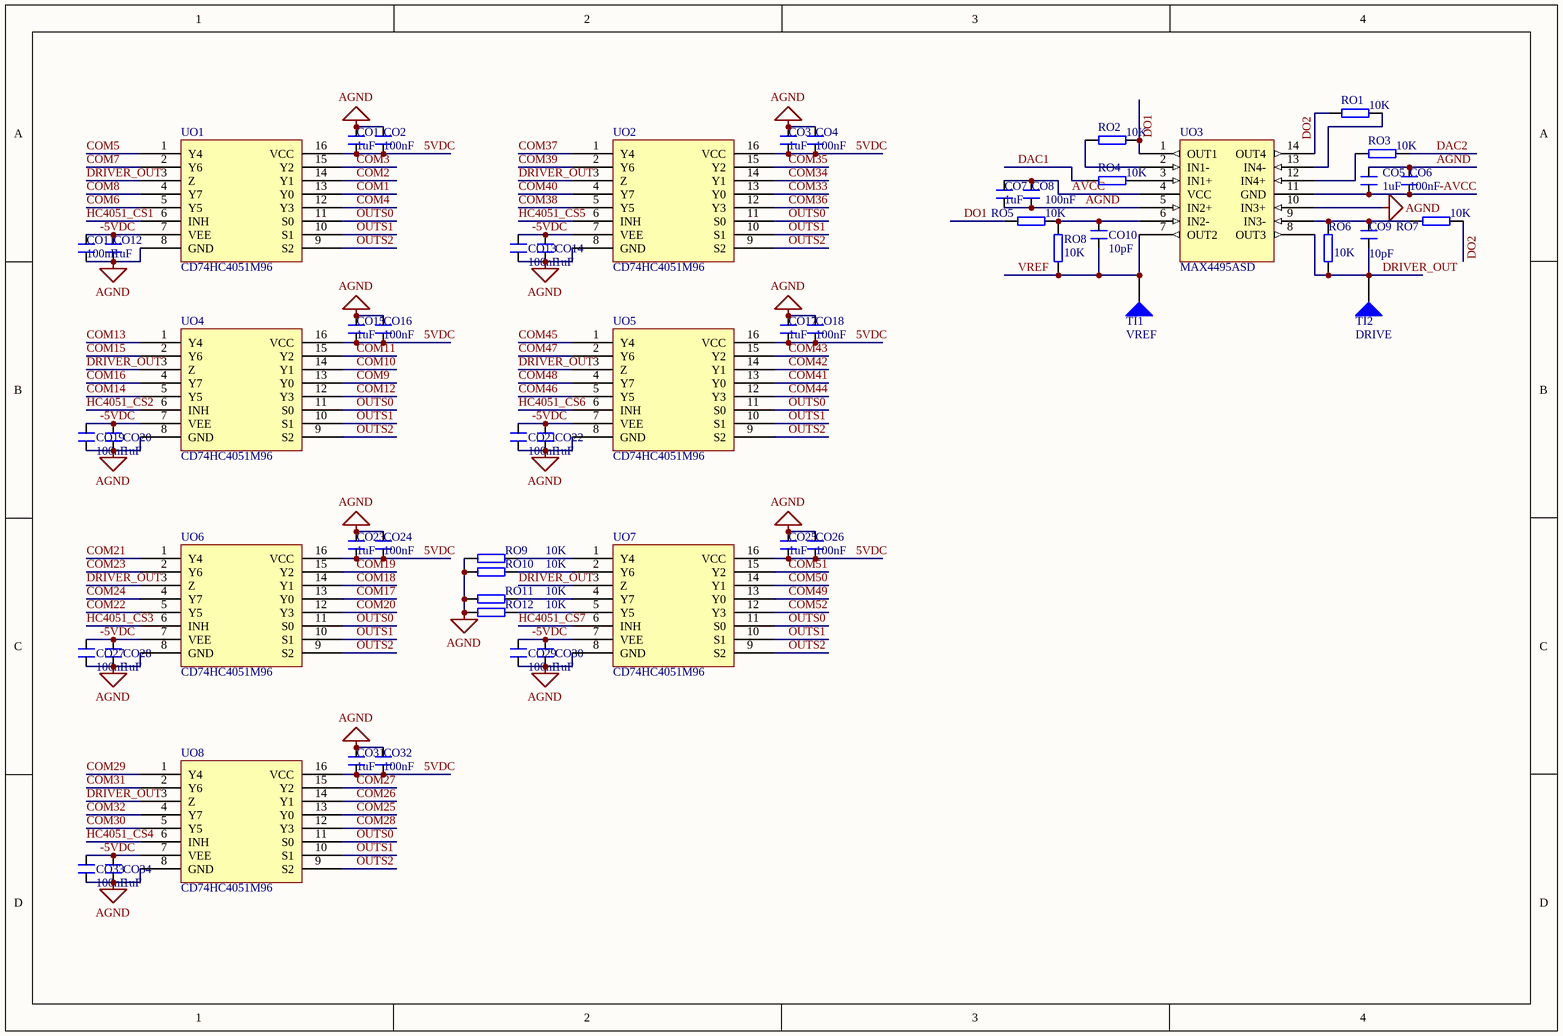
[diagram p3: Pressure_OUTPUT.SchDoc]

### Parts
CO1  1uF  [C0603_HSC100]
CO2  100nF  [C0603_HSC100]
CO3  1uF  [C0603_HSC100]
CO4  100nF  [C0603_HSC100]
CO5  1uF  [C0603_HSC100]
CO6  100nF  [C0603_HSC100]
CO7  1uF  [C0603_HSC100]
CO8  100nF  [C0603_HSC100]
CO9  10pF  [C0603_HSC100]
CO10  10pF  [C0603_HSC100]
CO11  100nF  [C0603_HSC100]
CO12  1uF  [C0603_HSC100]
CO13  100nF  [C0603_HSC100]
CO14  1uF  [C0603_HSC100]
CO15  1uF  [C0603_HSC100]
CO16  100nF  [C0603_HSC100]
CO17  1uF  [C0603_HSC100]
CO18  100nF  [C0603_HSC100]
CO19  100nF  [C0603_HSC100]
CO20  1uF  [C0603_HSC100]
CO21  100nF  [C0603_HSC100]
CO22  1uF  [C0603_HSC100]
CO23  1uF  [C0603_HSC100]
CO24  100nF  [C0603_HSC100]
CO25  1uF  [C0603_HSC100]
CO26  100nF  [C0603_HSC100]
CO27  100nF  [C0603_HSC100]
CO28  1uF  [C0603_HSC100]
CO29  100nF  [C0603_HSC100]
CO30  1uF  [C0603_HSC100]
CO31  1uF  [C0603_HSC100]
CO32  100nF  [C0603_HSC100]
CO33  100nF  [C0603_HSC100]
CO34  1uF  [C0603_HSC100]
RO1  10K  [R0603_HSC100]
RO2  10K  [R0603_HSC100]
RO3  10K  [R0603_HSC100]
RO4  10K  [R0603_HSC100]
RO5  10K  [R0603_HSC100]
RO6  10K  [R0603_HSC100]
RO7  10K  [R0603_HSC100]
RO8  10K  [R0603_HSC100]
RO9  10K  [R0603_HSC100]
RO10  10K  [R0603_HSC100]
RO11  10K  [R0603_HSC100]
RO12  10K  [R0603_HSC100]
TI1  VREF  [TPAD-2MM]
TI2  DRIVE  [TPAD-2MM]
UO1  CD74HC4051M96  [SO-16]
UO2  CD74HC4051M96  [SO-16]
UO3  MAX4495ASD  [SO-14]
UO4  CD74HC4051M96  [SO-16]
UO5  CD74HC4051M96  [SO-16]
UO6  CD74HC4051M96  [SO-16]
UO7  CD74HC4051M96  [SO-16]
UO8  CD74HC4051M96  [SO-16]

### Nets
5VDC: CO1.2 CO2.2 CO3.2 CO4.2 CO15.2 CO16.2 CO17.2 CO18.2 CO23.2 CO24.2 CO25.2 CO26.2 CO31.2 CO32.2 UO1.16(VCC) UO2.16(VCC) UO4.16(VCC) UO5.16(VCC) UO6.16(VCC) UO7.16(VCC) UO8.16(VCC)
AGND: CO1.1 CO2.1 CO3.1 CO4.1 CO5.1 CO6.1 CO7.2 CO8.2 CO11.1 CO12.1 CO13.1 CO14.1 CO15.1 CO16.1 CO17.1 CO18.1 CO19.1 CO20.1 CO21.1 CO22.1 CO23.1 CO24.1 CO25.1 CO26.1 CO27.1 CO28.1 CO29.1 CO30.1 CO31.1 CO32.1 CO33.1 CO34.1 RO9.1 RO10.1 RO11.1 RO12.1 UO1.8(GND) UO2.8(GND) UO3.5(IN2+) UO3.10(IN3+) UO4.8(GND) UO5.8(GND) UO6.8(GND) UO7.8(GND) UO8.8(GND)
-5VDC: CO11.2 CO12.2 CO13.2 CO14.2 CO19.2 CO20.2 CO21.2 CO22.2 CO27.2 CO28.2 CO29.2 CO30.2 CO33.2 CO34.2 UO1.7(VEE) UO2.7(VEE) UO4.7(VEE) UO5.7(VEE) UO6.7(VEE) UO7.7(VEE) UO8.7(VEE)
-AVCC: CO5.2 CO6.2 UO3.11(GND)
AVCC: CO7.1 CO8.1 UO3.4(VCC)
COM1: UO1.13(Y0)
COM2: UO1.14(Y1)
COM3: UO1.15(Y2)
COM4: UO1.12(Y3)
COM5: UO1.1(Y4)
COM6: UO1.5(Y5)
COM7: UO1.2(Y6)
COM8: UO1.4(Y7)
COM9: UO4.13(Y0)
COM10: UO4.14(Y1)
COM11: UO4.15(Y2)
COM12: UO4.12(Y3)
COM13: UO4.1(Y4)
COM14: UO4.5(Y5)
COM15: UO4.2(Y6)
COM16: UO4.4(Y7)
COM17: UO6.13(Y0)
COM18: UO6.14(Y1)
COM19: UO6.15(Y2)
COM20: UO6.12(Y3)
COM21: UO6.1(Y4)
COM22: UO6.5(Y5)
COM23: UO6.2(Y6)
COM24: UO6.4(Y7)
COM25: UO8.13(Y0)
COM26: UO8.14(Y1)
COM27: UO8.15(Y2)
COM28: UO8.12(Y3)
COM29: UO8.1(Y4)
COM30: UO8.5(Y5)
COM31: UO8.2(Y6)
COM32: UO8.4(Y7)
COM33: UO2.13(Y0)
COM34: UO2.14(Y1)
COM35: UO2.15(Y2)
COM36: UO2.12(Y3)
COM37: UO2.1(Y4)
COM38: UO2.5(Y5)
COM39: UO2.2(Y6)
COM40: UO2.4(Y7)
COM41: UO5.13(Y0)
COM42: UO5.14(Y1)
COM43: UO5.15(Y2)
COM44: UO5.12(Y3)
COM45: UO5.1(Y4)
COM46: UO5.5(Y5)
COM47: UO5.2(Y6)
COM48: UO5.4(Y7)
COM49: UO7.13(Y0)
COM50: UO7.14(Y1)
COM51: UO7.15(Y2)
COM52: UO7.12(Y3)
DAC1: RO4.1
DAC2: RO3.1
DO1: RO2.2 RO5.2 UO3.1(OUT1)
DO2: RO1.2 RO7.1 UO3.14(OUT4)
DRIVER_OUT: CO9.2 RO6.2 TI2.1 UO1.3(Z) UO2.3(Z) UO3.8(OUT3) UO4.3(Z) UO5.3(Z) UO6.3(Z) UO7.3(Z) UO8.3(Z)
HC4051_CS1: UO1.6(INH)
HC4051_CS2: UO4.6(INH)
HC4051_CS3: UO6.6(INH)
HC4051_CS4: UO8.6(INH)
HC4051_CS5: UO2.6(INH)
HC4051_CS6: UO5.6(INH)
HC4051_CS7: UO7.6(INH)
OUTS0: UO1.11(S0) UO2.11(S0) UO4.11(S0) UO5.11(S0) UO6.11(S0) UO7.11(S0) UO8.11(S0)
OUTS1: UO1.10(S1) UO2.10(S1) UO4.10(S1) UO5.10(S1) UO6.10(S1) UO7.10(S1) UO8.10(S1)
OUTS2: UO1.9(S2) UO2.9(S2) UO4.9(S2) UO5.9(S2) UO6.9(S2) UO7.9(S2) UO8.9(S2)
VREF: CO10.2 RO8.1 TI1.1 UO3.7(OUT2)
NetCO9_1: CO9.1 RO6.1 RO7.2 UO3.9(IN3-)
NetCO10_1: CO10.1 RO5.1 RO8.2 UO3.6(IN2-)
NetRO1_1: RO1.1 UO3.13(IN4-)
NetRO2_1: RO2.1 UO3.2(IN1-)
NetRO3_2: RO3.2 UO3.12(IN4+)
NetRO4_2: RO4.2 UO3.3(IN1+)
NetRO9_2: RO9.2 UO7.1(Y4)
NetRO10_2: RO10.2 UO7.2(Y6)
NetRO11_2: RO11.2 UO7.4(Y7)
NetRO12_2: RO12.2 UO7.5(Y5)

### Library data of the parts
CO1-CO34 = CAP_M
RO1-RO8 = RES
RO9-RO12 = RES_M
TI1 TI2 = TPAD: Connector
UO1 UO2 UO4-UO8 = 74HC4051
UO3 = LM324

## Sheet Pressure_MCU407.SchDoc
size A3
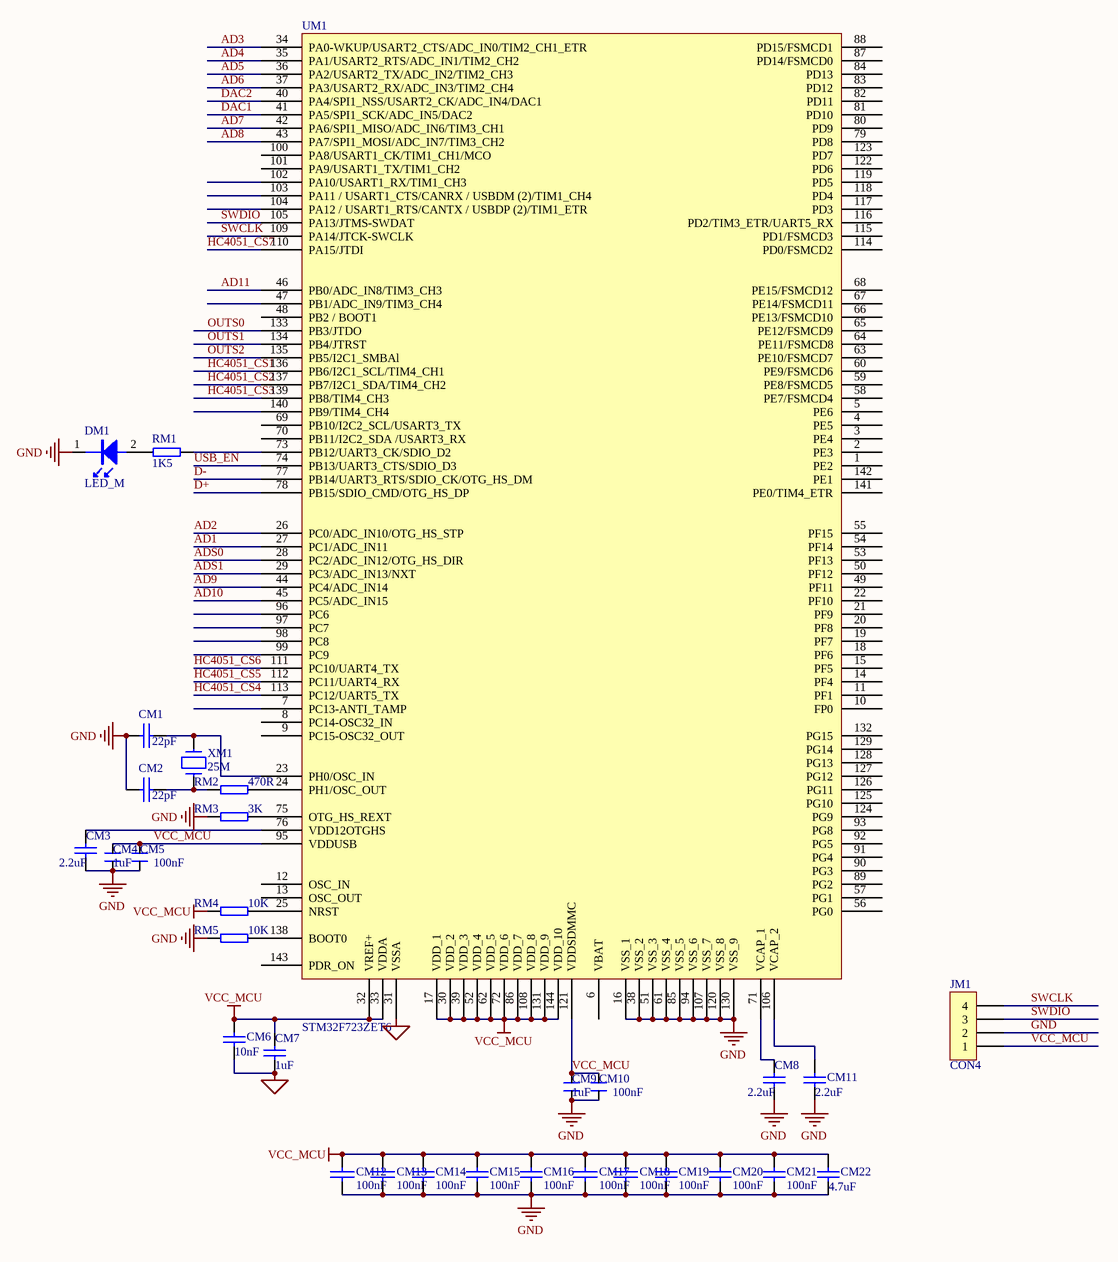
[diagram p4: Pressure_MCU407.SchDoc]

### Parts
CM1  22pF  [C0603_HSC100]
CM2  22pF  [c0603_HSC100]
CM3  2.2uF  [C0805]
CM4  1uF  [C0603_HSC100]
CM5  100nF  [C0603_HSC100]
CM6  10nF  [c0603_HSC100]
CM7  1uF  [c0603_HSC100]
CM8  2.2uF  [C0805]
CM9  1uF  [C0603_HSC100]
CM10  100nF  [C0603_HSC100]
CM11  2.2uF  [C0805]
CM12  100nF  [c0603_HSC100]
CM13  100nF  [c0603_HSC100]
CM14  100nF  [c0603_HSC100]
CM15  100nF  [c0603_HSC100]
CM16  100nF  [c0603_HSC100]
CM17  100nF  [c0603_HSC100]
CM18  100nF  [c0603_HSC100]
CM19  100nF  [c0603_HSC100]
CM20  100nF  [c0603_HSC100]
CM21  100nF  [c0603_HSC100]
CM22  4.7uF  [C0805]
DM1  LED_M  [LED_HSC100]
JM1  CON4  [SIP_4M_1.27]
RM1  1K5  [R0603_HSC100]
RM2  470R  [R0603_HSC100]
RM3  3K  [R0603_HSC100]
RM4  10K  [R0603_HSC100]
RM5  10K  [R0603_HSC100]
UM1  STM32F723ZET6  [LQFP144]
XM1  25M  [CRYSTAL_SMD]

### Nets
AGND: CM6.2 CM7.2 UM1.31(VSSA)
GND: CM1.1 CM2.1 CM3.1 CM4.2 CM5.2 CM8.1 CM9.2 CM10.2 CM11.1 CM12.2 CM13.2 CM14.1 CM15.1 CM16.1 CM17.2 CM18.2 CM19.1 CM20.1 CM21.1 CM22.1 DM1.1 JM1.2 RM3.2 RM5.1 UM1.16(VSS_1) UM1.38(VSS_2) UM1.51(VSS_3) UM1.61(VSS_4) UM1.85(VSS_5) UM1.94(VSS_6) UM1.107(VSS_7) UM1.120(VSS_8) UM1.130(VSS_9)
VCC_MCU: CM4.1 CM5.1 CM6.1 CM7.1 CM9.1 CM10.1 CM12.1 CM13.1 CM14.2 CM15.2 CM16.2 CM17.1 CM18.1 CM19.2 CM20.2 CM21.2 CM22.2 JM1.1 RM4.2 UM1.17(VDD_1) UM1.30(VDD_2) UM1.32(VREF+) UM1.33(VDDA) UM1.39(VDD_3) UM1.52(VDD_4) UM1.62(VDD_5) UM1.72(VDD_6) UM1.86(VDD_7) UM1.95(VDDUSB) UM1.108(VDD_8) UM1.121(VDDSDMMC) UM1.131(VDD_9) UM1.144(VDD_10)
AD1: UM1.27(PC1/ADC_IN11)
AD2: UM1.26(PC0/ADC_IN10/OTG_HS_STP)
AD3: UM1.34(PA0-WKUP/USART2_CTS/ADC_IN0/TIM2_CH1_ETR)
AD4: UM1.35(PA1/USART2_RTS/ADC_IN1/TIM2_CH2)
AD5: UM1.36(PA2/USART2_TX/ADC_IN2/TIM2_CH3)
AD6: UM1.37(PA3/USART2_RX/ADC_IN3/TIM2_CH4)
AD7: UM1.42(PA6/SPI1_MISO/ADC_IN6/TIM3_CH1)
AD8: UM1.43(PA7/SPI1_MOSI/ADC_IN7/TIM3_CH2)
AD9: UM1.44(PC4/ADC_IN14)
AD10: UM1.45(PC5/ADC_IN15)
AD11: UM1.46(PB0/ADC_IN8/TIM3_CH3)
ADS0: UM1.28(PC2/ADC_IN12/OTG_HS_DIR)
ADS1: UM1.29(PC3/ADC_IN13/NXT)
D+: UM1.78(PB15/SDIO_CMD/OTG_HS_DP)
D-: UM1.77(PB14/UART3_RTS/SDIO_CK/OTG_HS_DM)
DAC1: UM1.41(PA5/SPI1_SCK/ADC_IN5/DAC2)
DAC2: UM1.40(PA4/SPI1_NSS/USART2_CK/ADC_IN4/DAC1)
HC4051_CS1: UM1.136(PB6/I2C1_SCL/TIM4_CH1)
HC4051_CS2: UM1.137(PB7/I2C1_SDA/TIM4_CH2)
HC4051_CS3: UM1.139(PB8/TIM4_CH3)
HC4051_CS4: UM1.113(PC12/UART5_TX)
HC4051_CS5: UM1.112(PC11/UART4_RX)
HC4051_CS6: UM1.111(PC10/UART4_TX)
HC4051_CS7: UM1.110(PA15/JTDI)
OUTS0: UM1.133(PB3/JTDO)
OUTS1: UM1.134(PB4/JTRST)
OUTS2: UM1.135(PB5/I2C1_SMBAl)
SWCLK: JM1.4 UM1.109(PA14/JTCK-SWCLK)
SWDIO: JM1.3 UM1.105(PA13/JTMS-SWDAT)
USB_EN: UM1.74(PB13/UART3_CTS/SDIO_D3)
NetCM1_2: CM1.2 UM1.23(PH0/OSC_IN) XM1.2
NetCM2_2: CM2.2 RM2.2 XM1.1
NetCM3_2: CM3.2 UM1.76(VDD12OTGHS)
NetCM8_2: CM8.2 UM1.71(VCAP_1)
NetCM11_2: CM11.2 UM1.106(VCAP_2)
NetDM1_2: DM1.2 RM1.2
NetRM1_1: RM1.1 UM1.73(PB12/UART3_CK/SDIO_D2)
NetRM2_1: RM2.1 UM1.24(PH1/OSC_OUT)
NetRM3_1: RM3.1 UM1.75(OTG_HS_REXT)
NetRM4_1: RM4.1 UM1.25(NRST)
NetRM5_2: RM5.2 UM1.138(BOOT0)

Not connected (* = marked no-connect by the designer): UM1 1(PE2) 2(PE3) 3(PE4) 4(PE5) 5(PE6) 6(VBAT) 7(PC13-ANTI_TAMP) 8(PC14-OSC32_IN) 9(PC15-OSC32_OUT) 10(FP0) 11(PF1) 12(OSC_IN) 13(OSC_OUT) 14(PF4) 15(PF5) 18(PF6) 19(PF7) 20(PF8) 21(PF9) 22(PF10) 47(PB1/ADC_IN9/TIM3_CH4) 48(PB2_/_BOOT1) 49(PF11) 50(PF12) 53(PF13) 54(PF14) 55(PF15) 56(PG0) 57(PG1) 58(PE7/FSMCD4) 59(PE8/FSMCD5) 60(PE9/FSMCD6) 63(PE10/FSMCD7) 64(PE11/FSMCD8) 65(PE12/FSMCD9) 66(PE13/FSMCD10) 67(PE14/FSMCD11) 68(PE15/FSMCD12) 69(PB10/I2C2_SCL/USART3_TX) 70(PB11/I2C2_SDA_/USART3_RX) 79(PD8) 80(PD9) 81(PD10) 82(PD11) 83(PD12) 84(PD13) 87(PD14/FSMCD0) 88(PD15/FSMCD1) 89(PG2) 90(PG3) 91(PG4) 92(PG5) 93(PG8) 96(PC6) 97(PC7) 98(PC8) 99(PC9) 100(PA8/USART1_CK/TIM1_CH1/MCO) 101(PA9/USART1_TX/TIM1_CH2) 102(PA10/USART1_RX/TIM1_CH3) 103(PA11_/_USART1_CTS/CANRX_/_USBDM_(2)/TIM1_CH4) 104(PA12_/_USART1_RTS/CANTX_/_USBDP_(2)/TIM1_ETR) 114(PD0/FSMCD2) 115(PD1/FSMCD3) 116(PD2/TIM3_ETR/UART5_RX) 117(PD3) 118(PD4) 119(PD5) 122(PD6) 123(PD7) 124(PG9) 125(PG10) 126(PG11) 127(PG12) 128(PG13) 129(PG14) 132(PG15) 140(PB9/TIM4_CH4) 141(PE0/TIM4_ETR) 142(PE1) 143(PDR_ON)

### Library data of the parts
CM1 CM2 CM12 CM13 CM17 CM18 = CAP: Capacitor
CM3 CM6-CM8 CM11 CM14-CM16 CM19-CM22 = Cap: Capacitor; Value: 104; Published: 8-Jun-2000; LatestRevisionDate: 17-Jul-2002; LatestRevisionNote: Re-released for DXP Platform.; Publisher: Altium Limited
CM4 CM5 CM9 CM10 = CAP_M
JM1 = CON4: Connector
RM1 RM5 = RES_M
RM2-RM4 = RES
XM1 = CRYSTAL

## Sheet Pressure_ADIN.SchDoc
size A4
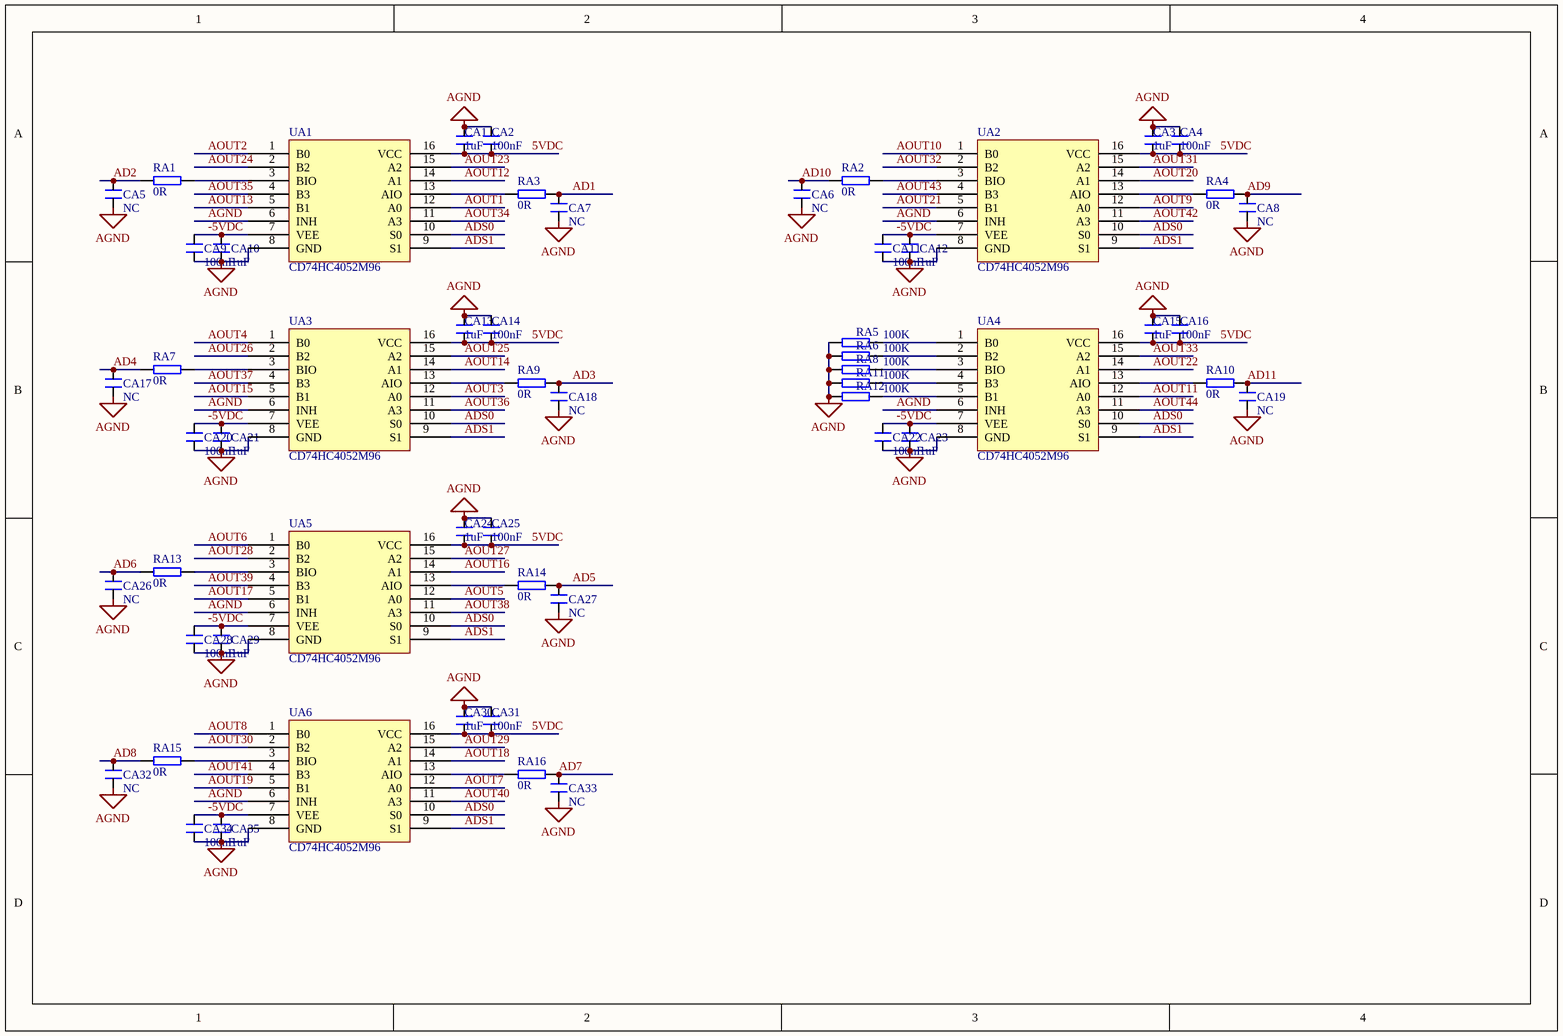
[diagram p5: Pressure_ADIN.SchDoc]

### Parts
CA1  1uF  [C0603_HSC100]
CA2  100nF  [C0603_HSC100]
CA3  1uF  [C0603_HSC100]
CA4  100nF  [C0603_HSC100]
CA5  NC  [C0603_HSC100]
CA6  NC  [C0603_HSC100]
CA7  NC  [C0603_HSC100]
CA8  NC  [C0603_HSC100]
CA9  100nF  [C0603_HSC100]
CA10  1uF  [C0603_HSC100]
CA11  100nF  [C0603_HSC100]
CA12  1uF  [C0603_HSC100]
CA13  1uF  [C0603_HSC100]
CA14  100nF  [C0603_HSC100]
CA15  1uF  [C0603_HSC100]
CA16  100nF  [C0603_HSC100]
CA17  NC  [C0603_HSC100]
CA18  NC  [C0603_HSC100]
CA19  NC  [C0603_HSC100]
CA20  100nF  [C0603_HSC100]
CA21  1uF  [C0603_HSC100]
CA22  100nF  [C0603_HSC100]
CA23  1uF  [C0603_HSC100]
CA24  1uF  [C0603_HSC100]
CA25  100nF  [C0603_HSC100]
CA26  NC  [C0603_HSC100]
CA27  NC  [C0603_HSC100]
CA28  100nF  [C0603_HSC100]
CA29  1uF  [C0603_HSC100]
CA30  1uF  [C0603_HSC100]
CA31  100nF  [C0603_HSC100]
CA32  NC  [C0603_HSC100]
CA33  NC  [C0603_HSC100]
CA34  100nF  [C0603_HSC100]
CA35  1uF  [C0603_HSC100]
RA1  0R  [R0603_HSC100]
RA2  0R  [R0603_HSC100]
RA3  0R  [R0603_HSC100]
RA4  0R  [R0603_HSC100]
RA5  100K  [R0603_HSC100]
RA6  100K  [R0603_HSC100]
RA7  0R  [R0603_HSC100]
RA8  100K  [R0603_HSC100]
RA9  0R  [R0603_HSC100]
RA10  0R  [R0603_HSC100]
RA11  100K  [R0603_HSC100]
RA12  100K  [R0603_HSC100]
RA13  0R  [R0603_HSC100]
RA14  0R  [R0603_HSC100]
RA15  0R  [R0603_HSC100]
RA16  0R  [R0603_HSC100]
UA1  CD74HC4052M96  [SO-16]
UA2  CD74HC4052M96  [SO-16]
UA3  CD74HC4052M96  [SO-16]
UA4  CD74HC4052M96  [SO-16]
UA5  CD74HC4052M96  [SO-16]
UA6  CD74HC4052M96  [SO-16]

### Nets
5VDC: CA1.2 CA2.2 CA3.2 CA4.2 CA13.2 CA14.2 CA15.2 CA16.2 CA24.2 CA25.2 CA30.2 CA31.2 UA1.16(VCC) UA2.16(VCC) UA3.16(VCC) UA4.16(VCC) UA5.16(VCC) UA6.16(VCC)
AGND: CA1.1 CA2.1 CA3.1 CA4.1 CA5.1 CA6.1 CA7.1 CA8.1 CA9.1 CA10.1 CA11.1 CA12.1 CA13.1 CA14.1 CA15.1 CA16.1 CA17.1 CA18.1 CA19.1 CA20.1 CA21.1 CA22.1 CA23.1 CA24.1 CA25.1 CA26.1 CA27.1 CA28.1 CA29.1 CA30.1 CA31.1 CA32.1 CA33.1 CA34.1 CA35.1 RA5.1 RA6.1 RA8.1 RA11.1 RA12.1 UA1.6(INH) UA1.8(GND) UA2.6(INH) UA2.8(GND) UA3.6(INH) UA3.8(GND) UA4.6(INH) UA4.8(GND) UA5.6(INH) UA5.8(GND) UA6.6(INH) UA6.8(GND)
-5VDC: CA9.2 CA10.2 CA11.2 CA12.2 CA20.2 CA21.2 CA22.2 CA23.2 CA28.2 CA29.2 CA34.2 CA35.2 UA1.7(VEE) UA2.7(VEE) UA3.7(VEE) UA4.7(VEE) UA5.7(VEE) UA6.7(VEE)
AD1: CA7.2 RA3.1
AD2: CA5.2 RA1.2
AD3: CA18.2 RA9.1
AD4: CA17.2 RA7.2
AD5: CA27.2 RA14.1
AD6: CA26.2 RA13.2
AD7: CA33.2 RA16.1
AD8: CA32.2 RA15.2
AD9: CA8.2 RA4.1
AD10: CA6.2 RA2.2
AD11: CA19.2 RA10.1
ADS0: UA1.10(S0) UA2.10(S0) UA3.10(S0) UA4.10(S0) UA5.10(S0) UA6.10(S0)
ADS1: UA1.9(S1) UA2.9(S1) UA3.9(S1) UA4.9(S1) UA5.9(S1) UA6.9(S1)
AOUT1: UA1.12(A0)
AOUT2: UA1.1(B0)
AOUT3: UA3.12(A0)
AOUT4: UA3.1(B0)
AOUT5: UA5.12(A0)
AOUT6: UA5.1(B0)
AOUT7: UA6.12(A0)
AOUT8: UA6.1(B0)
AOUT9: UA2.12(A0)
AOUT10: UA2.1(B0)
AOUT11: UA4.12(A0)
AOUT12: UA1.14(A1)
AOUT13: UA1.5(B1)
AOUT14: UA3.14(A1)
AOUT15: UA3.5(B1)
AOUT16: UA5.14(A1)
AOUT17: UA5.5(B1)
AOUT18: UA6.14(A1)
AOUT19: UA6.5(B1)
AOUT20: UA2.14(A1)
AOUT21: UA2.5(B1)
AOUT22: UA4.14(A1)
AOUT23: UA1.15(A2)
AOUT24: UA1.2(B2)
AOUT25: UA3.15(A2)
AOUT26: UA3.2(B2)
AOUT27: UA5.15(A2)
AOUT28: UA5.2(B2)
AOUT29: UA6.15(A2)
AOUT30: UA6.2(B2)
AOUT31: UA2.15(A2)
AOUT32: UA2.2(B2)
AOUT33: UA4.15(A2)
AOUT34: UA1.11(A3)
AOUT35: UA1.4(B3)
AOUT36: UA3.11(A3)
AOUT37: UA3.4(B3)
AOUT38: UA5.11(A3)
AOUT39: UA5.4(B3)
AOUT40: UA6.11(A3)
AOUT41: UA6.4(B3)
AOUT42: UA2.11(A3)
AOUT43: UA2.4(B3)
AOUT44: UA4.11(A3)
NetRA1_1: RA1.1 UA1.3(BIO)
NetRA2_1: RA2.1 UA2.3(BIO)
NetRA3_2: RA3.2 UA1.13(AIO)
NetRA4_2: RA4.2 UA2.13(AIO)
NetRA5_2: RA5.2 UA4.1(B0)
NetRA6_2: RA6.2 UA4.2(B2)
NetRA7_1: RA7.1 UA3.3(BIO)
NetRA8_2: RA8.2 UA4.3(BIO)
NetRA9_2: RA9.2 UA3.13(AIO)
NetRA10_2: RA10.2 UA4.13(AIO)
NetRA11_2: RA11.2 UA4.4(B3)
NetRA12_2: RA12.2 UA4.5(B1)
NetRA13_1: RA13.1 UA5.3(BIO)
NetRA14_2: RA14.2 UA5.13(AIO)
NetRA15_1: RA15.1 UA6.3(BIO)
NetRA16_2: RA16.2 UA6.13(AIO)

### Library data of the parts
CA1-CA35 = CAP_M
RA1-RA16 = RES
UA1-UA6 = 74HC4052

## Nets that join several sheets
5VDC: Pressure_PM (15 pins), Pressure_OUTPUT (21 pins), Pressure_ADIN (18 pins)
AGND: Pressure_SENSOR (8 pins), Pressure_PM (RP6.1), Pressure_INPUT (86 pins), Pressure_OUTPUT (45 pins), Pressure_MCU407 (CM6.2 CM7.2 UM1.31), Pressure_ADIN (52 pins)
GND: Pressure_PM (26 pins), Pressure_MCU407 (33 pins)
VCC_MCU: Pressure_PM (6 pins), Pressure_MCU407 (33 pins)
-5VDC: Pressure_PM (6 pins), Pressure_OUTPUT (21 pins), Pressure_ADIN (18 pins)
-AVCC: Pressure_PM (5 pins), Pressure_INPUT (33 pins), Pressure_OUTPUT (CO5.2 CO6.2 UO3.11)
AD1: Pressure_MCU407 (UM1.27), Pressure_ADIN (CA7.2 RA3.1)
AD2: Pressure_MCU407 (UM1.26), Pressure_ADIN (CA5.2 RA1.2)
AD3: Pressure_MCU407 (UM1.34), Pressure_ADIN (CA18.2 RA9.1)
AD4: Pressure_MCU407 (UM1.35), Pressure_ADIN (CA17.2 RA7.2)
AD5: Pressure_MCU407 (UM1.36), Pressure_ADIN (CA27.2 RA14.1)
AD6: Pressure_MCU407 (UM1.37), Pressure_ADIN (CA26.2 RA13.2)
AD7: Pressure_MCU407 (UM1.42), Pressure_ADIN (CA33.2 RA16.1)
AD8: Pressure_MCU407 (UM1.43), Pressure_ADIN (CA32.2 RA15.2)
AD9: Pressure_MCU407 (UM1.44), Pressure_ADIN (CA8.2 RA4.1)
AD10: Pressure_MCU407 (UM1.45), Pressure_ADIN (CA6.2 RA2.2)
AD11: Pressure_MCU407 (UM1.46), Pressure_ADIN (CA19.2 RA10.1)
ADS0: Pressure_MCU407 (UM1.28), Pressure_ADIN (6 pins)
ADS1: Pressure_MCU407 (UM1.29), Pressure_ADIN (6 pins)
AOUT1: Pressure_INPUT (CI4.1 RI1.1), Pressure_ADIN (UA1.12)
AOUT2: Pressure_INPUT (CI37.1 RI28.2), Pressure_ADIN (UA1.1)
AOUT3: Pressure_INPUT (CI31.1 RI19.1), Pressure_ADIN (UA3.12)
AOUT4: Pressure_INPUT (CI70.2 RI46.2), Pressure_ADIN (UA3.1)
AOUT5: Pressure_INPUT (CI34.2 RI22.2), Pressure_ADIN (UA5.12)
AOUT6: Pressure_INPUT (CI67.1 RI43.1), Pressure_ADIN (UA5.1)
AOUT7: Pressure_INPUT (CI1.1 RI4.2), Pressure_ADIN (UA6.12)
AOUT8: Pressure_INPUT (CI40.1 RI25.1), Pressure_ADIN (UA6.1)
AOUT9: Pressure_INPUT (CI76.1 RI49.1), Pressure_ADIN (UA2.12)
AOUT10: Pressure_INPUT (CI109.1 RI75.2), Pressure_ADIN (UA2.1)
AOUT11: Pressure_INPUT (CI103.1 RI67.1), Pressure_ADIN (UA4.12)
AOUT12: Pressure_INPUT (CI131.2 RI87.2), Pressure_ADIN (UA1.14)
AOUT13: Pressure_INPUT (CI106.2 RI70.2), Pressure_ADIN (UA1.5)
AOUT14: Pressure_INPUT (CI129.1 RI85.1), Pressure_ADIN (UA3.14)
AOUT15: Pressure_INPUT (CI73.1 RI52.2), Pressure_ADIN (UA3.5)
AOUT16: Pressure_INPUT (CI111.1 RI73.1), Pressure_ADIN (UA5.14)
AOUT17: Pressure_INPUT (CI5.1 RI2.1), Pressure_ADIN (UA5.5)
AOUT18: Pressure_INPUT (CI38.1 RI29.2), Pressure_ADIN (UA6.14)
AOUT19: Pressure_INPUT (CI32.1 RI20.1), Pressure_ADIN (UA6.5)
AOUT20: Pressure_INPUT (CI71.2 RI47.2), Pressure_ADIN (UA2.14)
AOUT21: Pressure_INPUT (CI35.2 RI23.2), Pressure_ADIN (UA2.5)
AOUT22: Pressure_INPUT (CI68.1 RI44.1), Pressure_ADIN (UA4.14)
AOUT23: Pressure_INPUT (CI2.1 RI5.2), Pressure_ADIN (UA1.15)
AOUT24: Pressure_INPUT (CI41.1 RI26.1), Pressure_ADIN (UA1.2)
AOUT25: Pressure_INPUT (CI77.1 RI50.1), Pressure_ADIN (UA3.15)
AOUT26: Pressure_INPUT (CI110.1 RI76.2), Pressure_ADIN (UA3.2)
AOUT27: Pressure_INPUT (CI104.1 RI68.1), Pressure_ADIN (UA5.15)
AOUT28: Pressure_INPUT (CI132.2 RI88.2), Pressure_ADIN (UA5.2)
AOUT29: Pressure_INPUT (CI107.2 RI71.2), Pressure_ADIN (UA6.15)
AOUT30: Pressure_INPUT (CI130.1 RI86.1), Pressure_ADIN (UA6.2)
AOUT31: Pressure_INPUT (CI74.1 RI53.2), Pressure_ADIN (UA2.15)
AOUT32: Pressure_INPUT (CI112.1 RI74.1), Pressure_ADIN (UA2.2)
AOUT33: Pressure_INPUT (CI6.1 RI3.1), Pressure_ADIN (UA4.15)
AOUT34: Pressure_INPUT (CI39.1 RI30.2), Pressure_ADIN (UA1.11)
AOUT35: Pressure_INPUT (CI33.1 RI21.1), Pressure_ADIN (UA1.4)
AOUT36: Pressure_INPUT (CI72.2 RI48.2), Pressure_ADIN (UA3.11)
AOUT37: Pressure_INPUT (CI36.2 RI24.2), Pressure_ADIN (UA3.4)
AOUT38: Pressure_INPUT (CI69.1 RI45.1), Pressure_ADIN (UA5.11)
AOUT39: Pressure_INPUT (CI3.1 RI6.2), Pressure_ADIN (UA5.4)
AOUT40: Pressure_INPUT (CI42.1 RI27.1), Pressure_ADIN (UA6.11)
AOUT41: Pressure_INPUT (CI78.1 RI51.1), Pressure_ADIN (UA6.4)
AOUT42: Pressure_INPUT (CI75.1 RI54.2), Pressure_ADIN (UA2.11)
AOUT43: Pressure_INPUT (CI105.1 RI69.1), Pressure_ADIN (UA2.4)
AOUT44: Pressure_INPUT (CI108.2 RI72.2), Pressure_ADIN (UA4.11)
AVCC: Pressure_PM (CP9.2 CP10.2 TP3.1 UP3.5), Pressure_INPUT (33 pins), Pressure_OUTPUT (CO7.1 CO8.1 UO3.4)
COM1: Pressure_SENSOR (CS1.2 PS1.1 RS1.2), Pressure_OUTPUT (UO1.13)
COM2: Pressure_SENSOR (CS2.2 PS1.2 RS2.2), Pressure_OUTPUT (UO1.14)
COM3: Pressure_SENSOR (CS3.2 PS1.3 RS3.2), Pressure_OUTPUT (UO1.15)
COM4: Pressure_SENSOR (CS4.2 PS1.4 RS4.2), Pressure_OUTPUT (UO1.12)
COM5: Pressure_SENSOR (CS5.2 PS1.5 RS5.2), Pressure_OUTPUT (UO1.1)
COM6: Pressure_SENSOR (CS6.2 PS1.6 RS6.2), Pressure_OUTPUT (UO1.5)
COM7: Pressure_SENSOR (CS7.2 PS1.7 RS7.2), Pressure_OUTPUT (UO1.2)
COM8: Pressure_SENSOR (CS8.2 PS1.8 RS8.2), Pressure_OUTPUT (UO1.4)
COM9: Pressure_SENSOR (CS9.2 PS1.9 RS9.2), Pressure_OUTPUT (UO4.13)
COM10: Pressure_SENSOR (CS10.2 PS1.10 RS10.2), Pressure_OUTPUT (UO4.14)
COM11: Pressure_SENSOR (CS11.2 PS1.11 RS11.2), Pressure_OUTPUT (UO4.15)
COM12: Pressure_SENSOR (CS12.2 PS1.12 RS12.2), Pressure_OUTPUT (UO4.12)
COM13: Pressure_SENSOR (CS13.2 PS1.13 RS13.2), Pressure_OUTPUT (UO4.1)
COM14: Pressure_SENSOR (CS14.2 PS1.14 RS14.2), Pressure_OUTPUT (UO4.5)
COM15: Pressure_SENSOR (CS15.2 PS1.15 RS15.2), Pressure_OUTPUT (UO4.2)
COM16: Pressure_SENSOR (CS16.2 PS1.16 RS16.2), Pressure_OUTPUT (UO4.4)
COM17: Pressure_SENSOR (CS17.2 PS1.17 RS17.2), Pressure_OUTPUT (UO6.13)
COM18: Pressure_SENSOR (CS18.2 PS1.18 RS18.2), Pressure_OUTPUT (UO6.14)
COM19: Pressure_SENSOR (CS19.2 PS1.19 RS19.2), Pressure_OUTPUT (UO6.15)
COM20: Pressure_SENSOR (CS20.2 PS1.20 RS20.2), Pressure_OUTPUT (UO6.12)
COM21: Pressure_SENSOR (CS21.2 PS1.21 RS21.2), Pressure_OUTPUT (UO6.1)
COM22: Pressure_SENSOR (CS22.2 PS1.22 RS22.2), Pressure_OUTPUT (UO6.5)
COM23: Pressure_SENSOR (CS23.2 PS1.23 RS23.2), Pressure_OUTPUT (UO6.2)
COM24: Pressure_SENSOR (CS24.2 PS1.24 RS24.2), Pressure_OUTPUT (UO6.4)
COM25: Pressure_SENSOR (CS25.2 PS1.25 RS25.2), Pressure_OUTPUT (UO8.13)
COM26: Pressure_SENSOR (CS26.2 PS1.26 RS26.2), Pressure_OUTPUT (UO8.14)
COM27: Pressure_SENSOR (CS27.2 PS4.1 RS27.2), Pressure_OUTPUT (UO8.15)
COM28: Pressure_SENSOR (CS28.2 PS4.2 RS28.2), Pressure_OUTPUT (UO8.12)
COM29: Pressure_SENSOR (CS29.2 PS4.3 RS29.2), Pressure_OUTPUT (UO8.1)
COM30: Pressure_SENSOR (CS30.2 PS4.4 RS30.2), Pressure_OUTPUT (UO8.5)
COM31: Pressure_SENSOR (CS31.2 PS4.5 RS31.2), Pressure_OUTPUT (UO8.2)
COM32: Pressure_SENSOR (CS32.2 PS4.6 RS32.2), Pressure_OUTPUT (UO8.4)
COM33: Pressure_SENSOR (CS33.2 PS4.7 RS33.2), Pressure_OUTPUT (UO2.13)
COM34: Pressure_SENSOR (CS34.2 PS4.8 RS34.2), Pressure_OUTPUT (UO2.14)
COM35: Pressure_SENSOR (CS35.2 PS4.9 RS35.2), Pressure_OUTPUT (UO2.15)
COM36: Pressure_SENSOR (CS36.2 PS4.10 RS36.2), Pressure_OUTPUT (UO2.12)
COM37: Pressure_SENSOR (CS37.2 PS4.11 RS37.2), Pressure_OUTPUT (UO2.1)
COM38: Pressure_SENSOR (CS38.2 PS4.12 RS38.2), Pressure_OUTPUT (UO2.5)
COM39: Pressure_SENSOR (CS39.2 PS4.13 RS39.2), Pressure_OUTPUT (UO2.2)
COM40: Pressure_SENSOR (CS40.2 PS4.14 RS40.2), Pressure_OUTPUT (UO2.4)
COM41: Pressure_SENSOR (CS41.2 PS4.15 RS41.2), Pressure_OUTPUT (UO5.13)
COM42: Pressure_SENSOR (CS42.2 PS4.16 RS42.2), Pressure_OUTPUT (UO5.14)
COM43: Pressure_SENSOR (CS43.2 PS4.17 RS43.2), Pressure_OUTPUT (UO5.15)
COM44: Pressure_SENSOR (CS44.2 PS4.18 RS44.2), Pressure_OUTPUT (UO5.12)
COM45: Pressure_SENSOR (CS45.2 PS4.19 RS45.2), Pressure_OUTPUT (UO5.1)
COM46: Pressure_SENSOR (CS46.2 PS4.20 RS46.2), Pressure_OUTPUT (UO5.5)
COM47: Pressure_SENSOR (CS47.2 PS4.21 RS47.2), Pressure_OUTPUT (UO5.2)
COM48: Pressure_SENSOR (CS48.2 PS4.22 RS48.2), Pressure_OUTPUT (UO5.4)
COM49: Pressure_SENSOR (CS52.2 PS4.23 RS52.2), Pressure_OUTPUT (UO7.13)
COM50: Pressure_SENSOR (CS51.2 PS4.24 RS51.2), Pressure_OUTPUT (UO7.14)
COM51: Pressure_SENSOR (CS50.2 PS4.25 RS50.2), Pressure_OUTPUT (UO7.15)
COM52: Pressure_SENSOR (CS49.2 PS4.26 RS49.2), Pressure_OUTPUT (UO7.12)
D+: Pressure_PM (LP1.1), Pressure_MCU407 (UM1.78)
D-: Pressure_PM (LP1.2), Pressure_MCU407 (UM1.77)
DAC1: Pressure_OUTPUT (RO4.1), Pressure_MCU407 (UM1.41)
DAC2: Pressure_OUTPUT (RO3.1), Pressure_MCU407 (UM1.40)
HC4051_CS1: Pressure_OUTPUT (UO1.6), Pressure_MCU407 (UM1.136)
HC4051_CS2: Pressure_OUTPUT (UO4.6), Pressure_MCU407 (UM1.137)
HC4051_CS3: Pressure_OUTPUT (UO6.6), Pressure_MCU407 (UM1.139)
HC4051_CS4: Pressure_OUTPUT (UO8.6), Pressure_MCU407 (UM1.113)
HC4051_CS5: Pressure_OUTPUT (UO2.6), Pressure_MCU407 (UM1.112)
HC4051_CS6: Pressure_OUTPUT (UO5.6), Pressure_MCU407 (UM1.111)
HC4051_CS7: Pressure_OUTPUT (UO7.6), Pressure_MCU407 (UM1.110)
LIN1: Pressure_SENSOR (PS2.22), Pressure_INPUT (CI7.2 RI7.1 UI1.2)
LIN2: Pressure_SENSOR (PS3.1), Pressure_INPUT (CI46.2 RI34.1 UI4.13)
LIN3: Pressure_SENSOR (PS2.21), Pressure_INPUT (CI25.1 RI13.1 UI1.6)
LIN4: Pressure_SENSOR (PS3.2), Pressure_INPUT (CI62.1 RI38.2 UI4.9)
LIN5: Pressure_SENSOR (PS2.20), Pressure_INPUT (CI26.1 RI14.2 UI1.9)
LIN6: Pressure_SENSOR (PS3.3), Pressure_INPUT (CI61.1 RI37.1 UI4.6)
LIN7: Pressure_SENSOR (PS2.19), Pressure_INPUT (CI10.2 RI10.1 UI1.13)
LIN8: Pressure_SENSOR (PS3.4), Pressure_INPUT (CI43.2 RI31.1 UI4.2)
LIN9: Pressure_SENSOR (PS2.18), Pressure_INPUT (CI79.2 RI55.1 UI7.2)
LIN10: Pressure_SENSOR (PS3.5), Pressure_INPUT (CI115.2 RI79.1 UI10.13)
LIN11: Pressure_SENSOR (PS2.17), Pressure_INPUT (CI97.1 RI61.1 UI7.6)
LIN12: Pressure_SENSOR (PS3.6), Pressure_INPUT (CI126.1 RI82.2 UI10.9)
LIN13: Pressure_SENSOR (PS2.16), Pressure_INPUT (CI98.1 RI62.2 UI7.9)
LIN14: Pressure_SENSOR (PS3.7), Pressure_INPUT (CI125.1 RI81.1 UI10.6)
LIN15: Pressure_SENSOR (PS2.15), Pressure_INPUT (CI82.2 RI58.1 UI7.13)
LIN16: Pressure_SENSOR (PS3.8), Pressure_INPUT (CI113.2 RI77.1 UI10.2)
LIN17: Pressure_SENSOR (PS2.14), Pressure_INPUT (CI8.2 RI8.1 UI2.2)
LIN18: Pressure_SENSOR (PS3.9), Pressure_INPUT (CI47.2 RI35.1 UI5.13)
LIN19: Pressure_SENSOR (PS2.13), Pressure_INPUT (CI27.1 RI15.1 UI2.6)
LIN20: Pressure_SENSOR (PS3.10), Pressure_INPUT (CI64.1 RI40.2 UI5.9)
LIN21: Pressure_SENSOR (PS2.12), Pressure_INPUT (CI28.1 RI16.2 UI2.9)
LIN22: Pressure_SENSOR (PS3.11), Pressure_INPUT (CI63.1 RI39.1 UI5.6)
LIN23: Pressure_SENSOR (PS2.11), Pressure_INPUT (CI11.2 RI11.1 UI2.13)
LIN24: Pressure_SENSOR (PS3.12), Pressure_INPUT (CI44.2 RI32.1 UI5.2)
LIN25: Pressure_SENSOR (PS2.10), Pressure_INPUT (CI80.2 RI56.1 UI8.2)
LIN26: Pressure_SENSOR (PS3.13), Pressure_INPUT (CI116.2 RI80.1 UI11.13)
LIN27: Pressure_SENSOR (PS2.9), Pressure_INPUT (CI99.1 RI63.1 UI8.6)
LIN28: Pressure_SENSOR (PS3.14), Pressure_INPUT (CI128.1 RI84.2 UI11.9)
LIN29: Pressure_SENSOR (PS2.8), Pressure_INPUT (CI100.1 RI64.2 UI8.9)
LIN30: Pressure_SENSOR (PS3.15), Pressure_INPUT (CI127.1 RI83.1 UI11.6)
LIN31: Pressure_SENSOR (PS2.7), Pressure_INPUT (CI83.2 RI59.1 UI8.13)
LIN32: Pressure_SENSOR (PS3.16), Pressure_INPUT (CI114.2 RI78.1 UI11.2)
LIN33: Pressure_SENSOR (PS2.6), Pressure_INPUT (CI9.2 RI9.1 UI3.2)
LIN34: Pressure_SENSOR (PS3.17), Pressure_INPUT (CI48.2 RI36.1 UI6.13)
LIN35: Pressure_SENSOR (PS2.5), Pressure_INPUT (CI29.1 RI17.1 UI3.6)
LIN36: Pressure_SENSOR (PS3.18), Pressure_INPUT (CI66.1 RI42.2 UI6.9)
LIN37: Pressure_SENSOR (PS2.4), Pressure_INPUT (CI30.1 RI18.2 UI3.9)
LIN38: Pressure_SENSOR (PS3.19), Pressure_INPUT (CI65.1 RI41.1 UI6.6)
LIN39: Pressure_SENSOR (PS2.3), Pressure_INPUT (CI12.2 RI12.1 UI3.13)
LIN40: Pressure_SENSOR (PS3.20), Pressure_INPUT (CI45.2 RI33.1 UI6.2)
LIN41: Pressure_SENSOR (PS2.2), Pressure_INPUT (CI81.2 RI57.1 UI9.2)
LIN42: Pressure_SENSOR (PS3.21), Pressure_INPUT (CI84.2 RI60.1 UI9.13)
LIN43: Pressure_SENSOR (PS2.1), Pressure_INPUT (CI101.1 RI65.1 UI9.6)
LIN44: Pressure_SENSOR (PS3.22), Pressure_INPUT (CI102.1 RI66.2 UI9.9)
OUTS0: Pressure_OUTPUT (7 pins), Pressure_MCU407 (UM1.133)
OUTS1: Pressure_OUTPUT (7 pins), Pressure_MCU407 (UM1.134)
OUTS2: Pressure_OUTPUT (7 pins), Pressure_MCU407 (UM1.135)
USB_EN: Pressure_PM (QP1.1 RP3.2), Pressure_MCU407 (UM1.74)
VREF: Pressure_SENSOR (104 pins), Pressure_INPUT (44 pins), Pressure_OUTPUT (CO10.2 RO8.1 TI1.1 UO3.7)